# EAGLE design Power Stage (EAGLE 5.11)

## Sheet 1 of 5
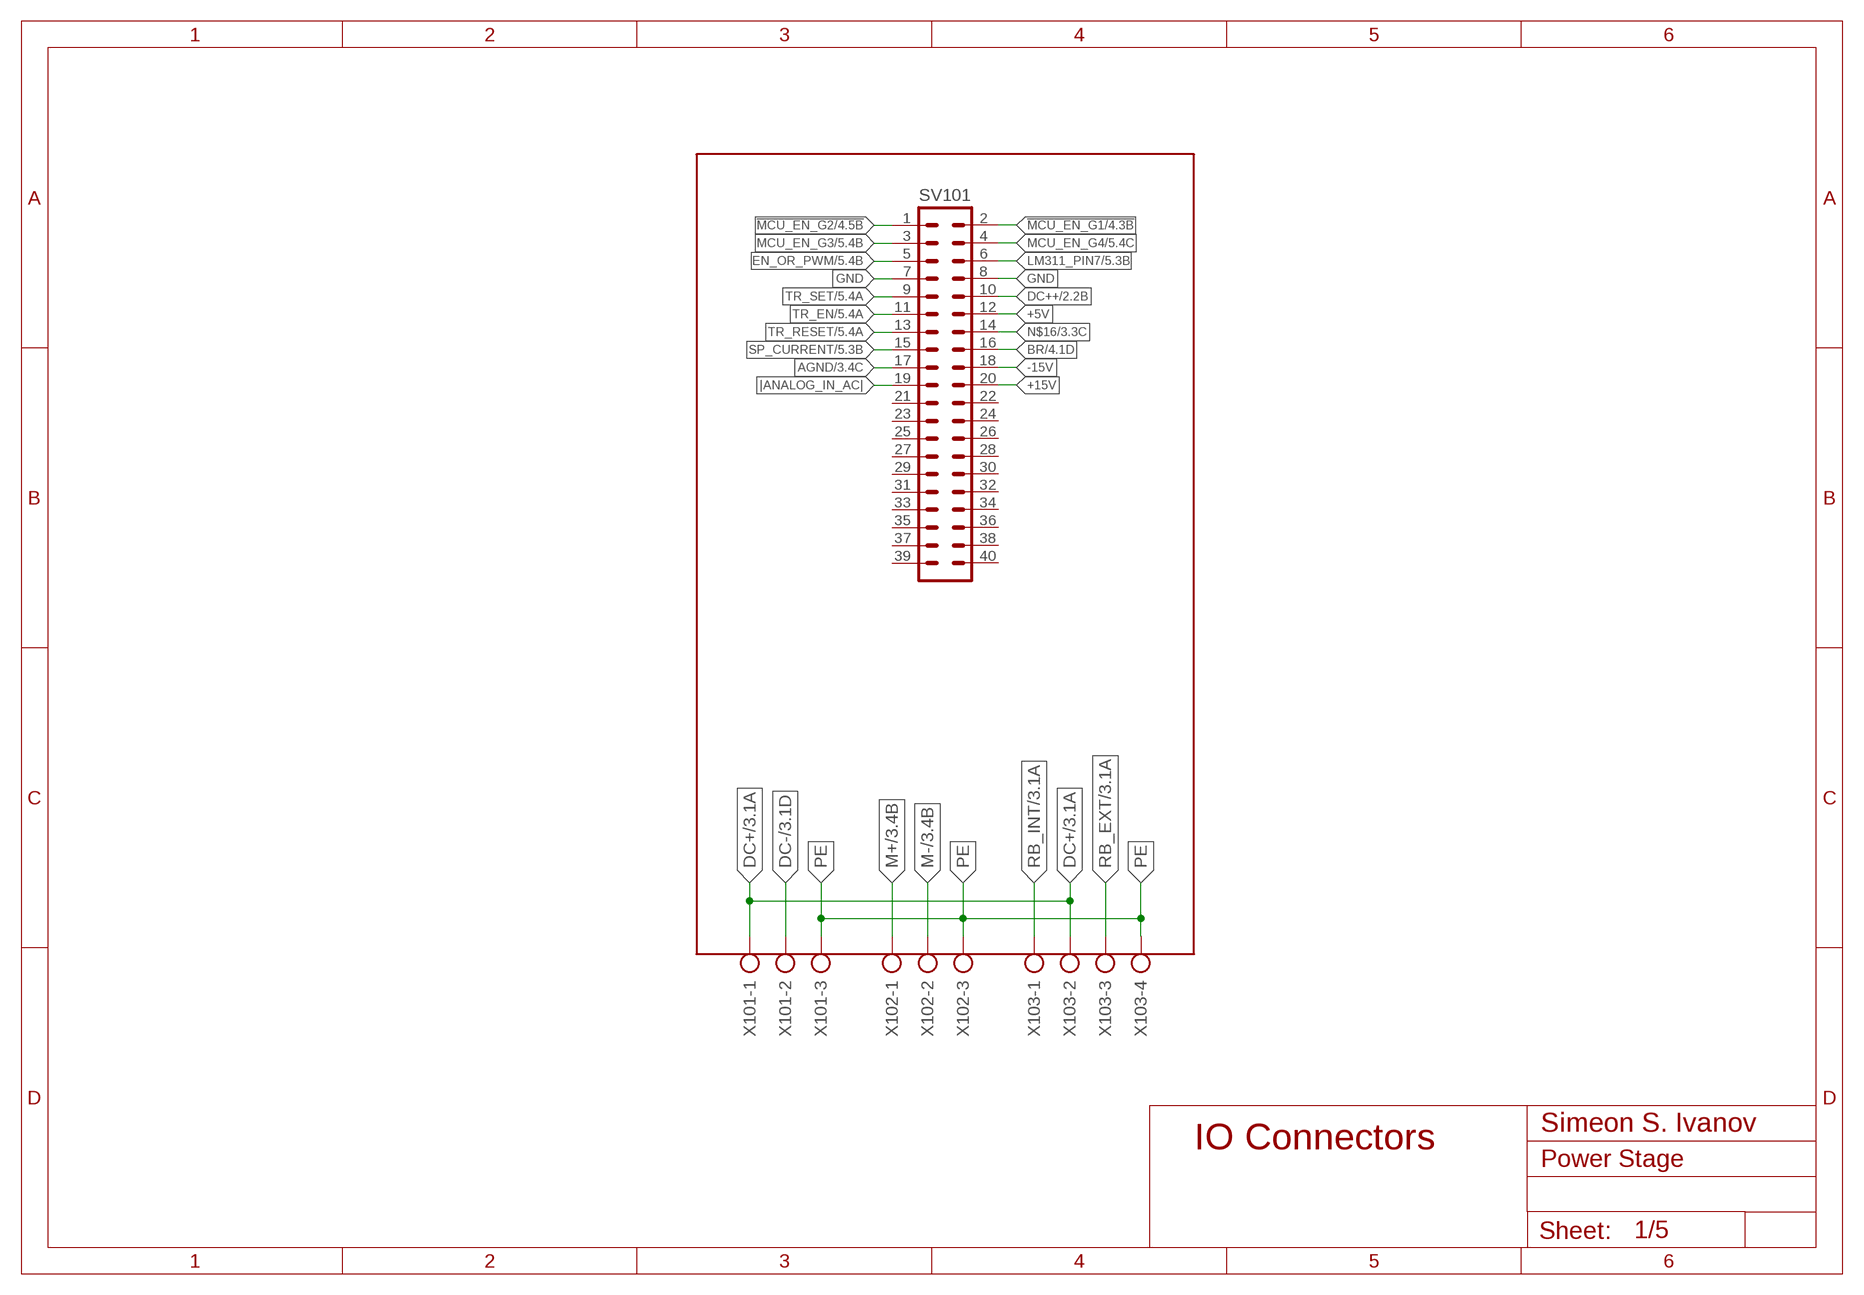
[diagram p0: schematic, sheet 1]

### Parts
SV101  ML40  [ML40]
X101  AK500/3-H  [AK500/3-H]
X102  AK500/3-H  [AK500/3-H]
X103  AK500/4-H  [AK500/4-H]

### Nets
!MCU_EN_G1: SV101.2 ; also sheet 4,5
!MCU_EN_G2: SV101.1 ; also sheet 4,5
+5V: SV101.12 ; also sheet 2,5
+15V: SV101.20 ; also sheet 2,5
-15V: SV101.18 ; also sheet 2,5
AGND: SV101.17 ; also sheet 2,3,5
BR: SV101.16 ; also sheet 4
DC+: X101.1 X103.2 ; also sheet 3
DC++: SV101.10 ; also sheet 2,3,4
DC-: X101.2 ; also sheet 3,4
EN_OR_PWM: SV101.5 ; also sheet 5
GND: SV101.7 SV101.8 ; also sheet 2,3,4,5
LM311_PIN7: SV101.6 ; also sheet 5
M+: X102.1 ; also sheet 3
M-: X102.2 ; also sheet 3
MCU_EN_G3: SV101.3 ; also sheet 5
MCU_EN_G4: SV101.4 ; also sheet 5
N$16: SV101.14 ; also sheet 3
PE: X101.3 X102.3 X103.4
RB_EXT: X103.3 ; also sheet 3
RB_INT: X103.1 ; also sheet 3
SP_CURRENT: SV101.15 ; also sheet 5
TR_EN: SV101.11 ; also sheet 5
TR_RESET: SV101.13 ; also sheet 5
TR_SET: SV101.9 ; also sheet 5
|ANALOG_IN_AC|: SV101.19 ; also sheet 5
Unconnected: SV101.21 SV101.22 SV101.23 SV101.24 SV101.25 SV101.26 SV101.27 SV101.28 SV101.29 SV101.30 SV101.31 SV101.32 SV101.33 SV101.34 SV101.35 SV101.36 SV101.37 SV101.38 SV101.39 SV101.40

### Notes on the sheet
- Simeon S. Ivanov
- IO Connectors

## Sheet 2 of 5
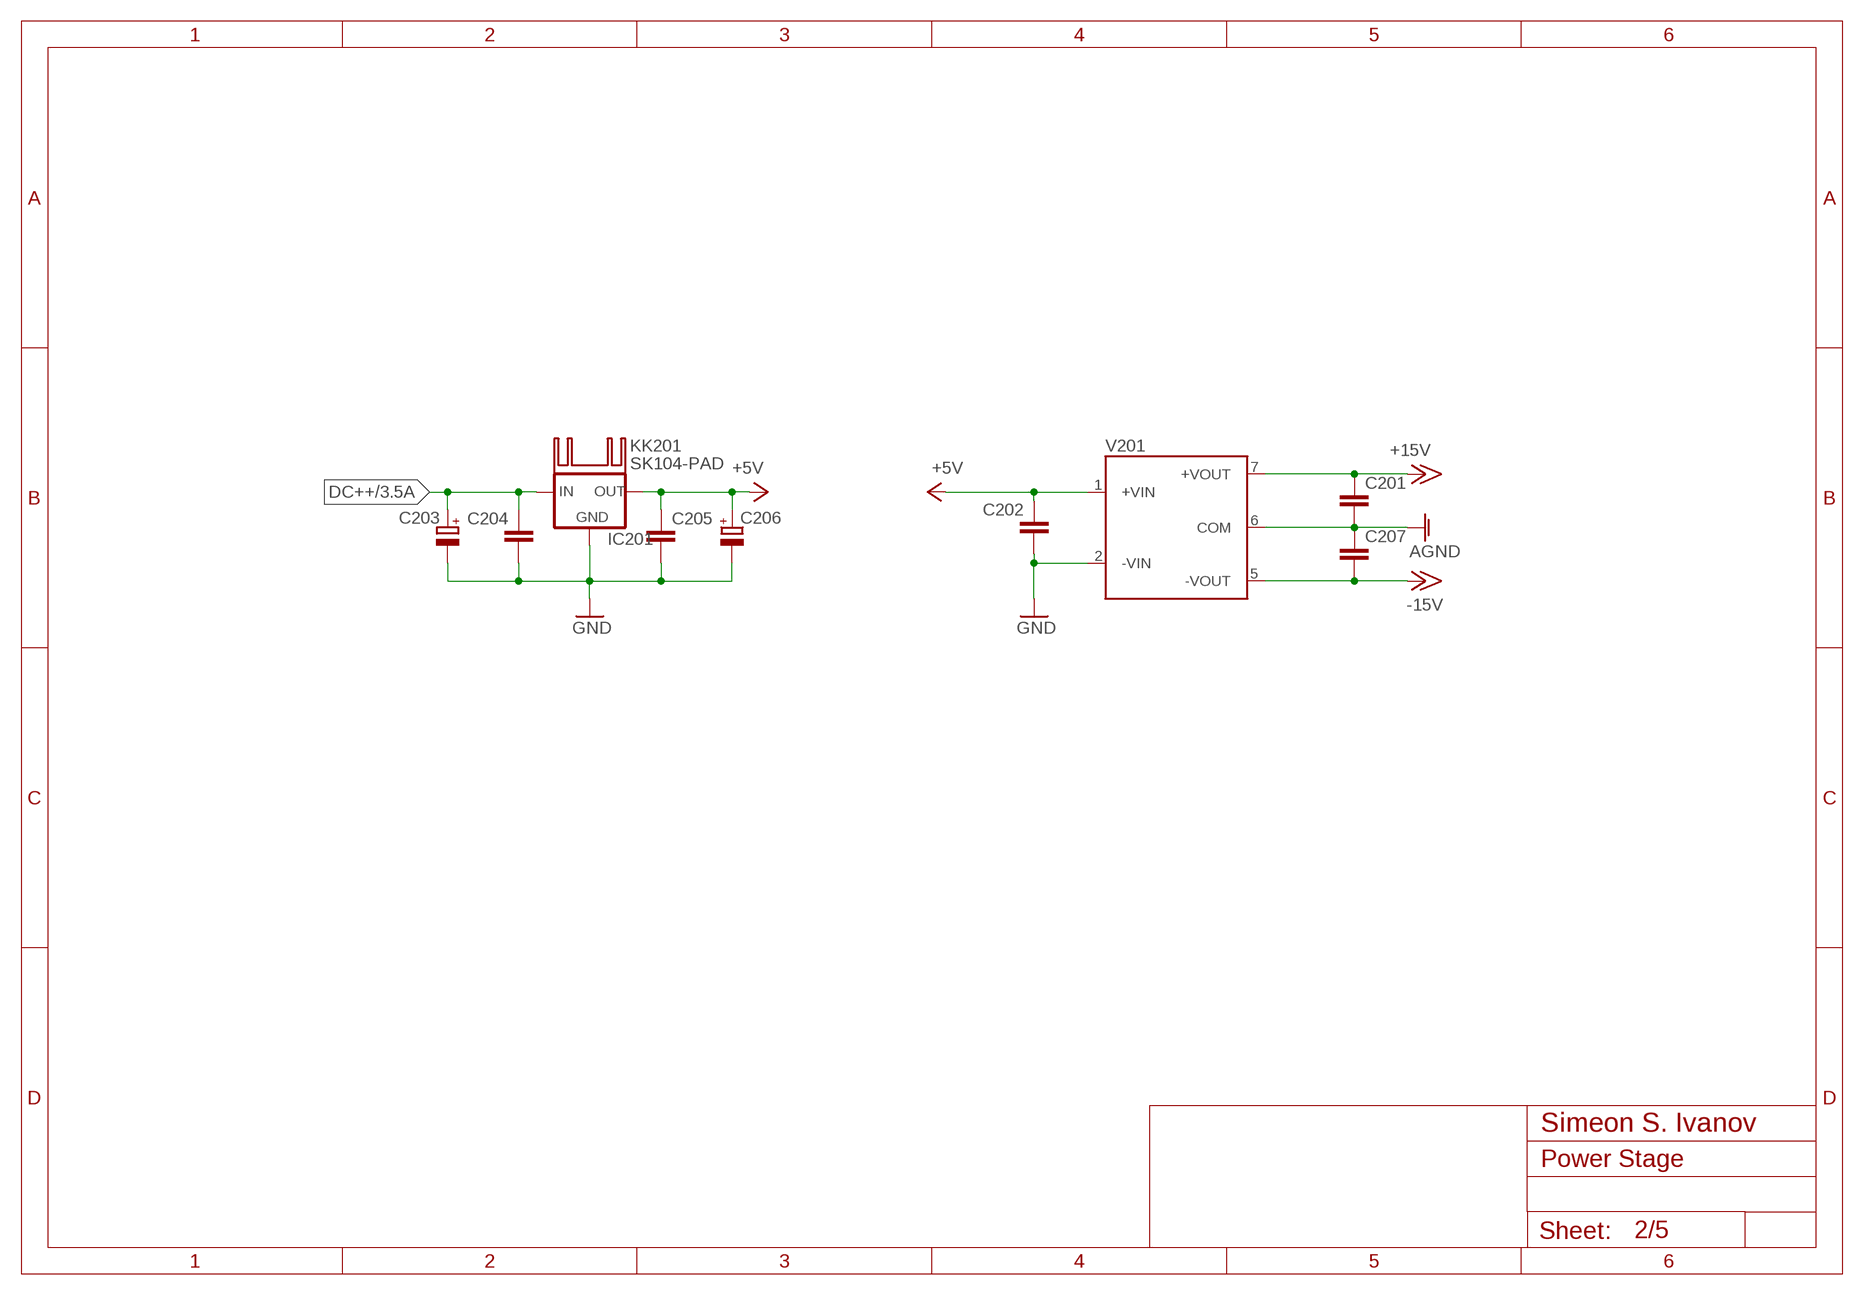
[diagram p1: schematic, sheet 2]

### Parts
C201  C-EU050-024X044  [C050-024X044]
C202  C-EU050-024X044  [C050-024X044]
C203  CPOL-EUE2.5-6  [E2,5-6]
C204  C-EU050-024X044  [C050-024X044]
C205  C-EU050-024X044  [C050-024X044]
C206  CPOL-EUE2.5-6  [E2,5-6]
C207  C-EU050-024X044  [C050-024X044]
IC201  78XXS  [78XXS]
KK201  SK104-PAD  [SK104-PAD]
V201  TMV0515D  [TMV_DUAL]

### Nets
+5V: C202.1 C205.1 C206.+ IC201.OUT V201.1(+VIN) ; also sheet 1,5
+15V: C201.1 V201.7(+VOUT) ; also sheet 1,5
-15V: C207.2 V201.5(-VOUT) ; also sheet 1,5
AGND: C201.2 C207.1 V201.6(COM) ; also sheet 1,3,5
DC++: C203.+ C204.1 IC201.IN ; also sheet 1,3,4
GND: C202.2 C203.- C204.2 C205.2 C206.- IC201.GND V201.2(-VIN) ; also sheet 1,3,4,5
Unconnected: KK201.K1(K) KK201.K2(K)

### Notes on the sheet
- Simeon S. Ivanov

## Sheet 3 of 5
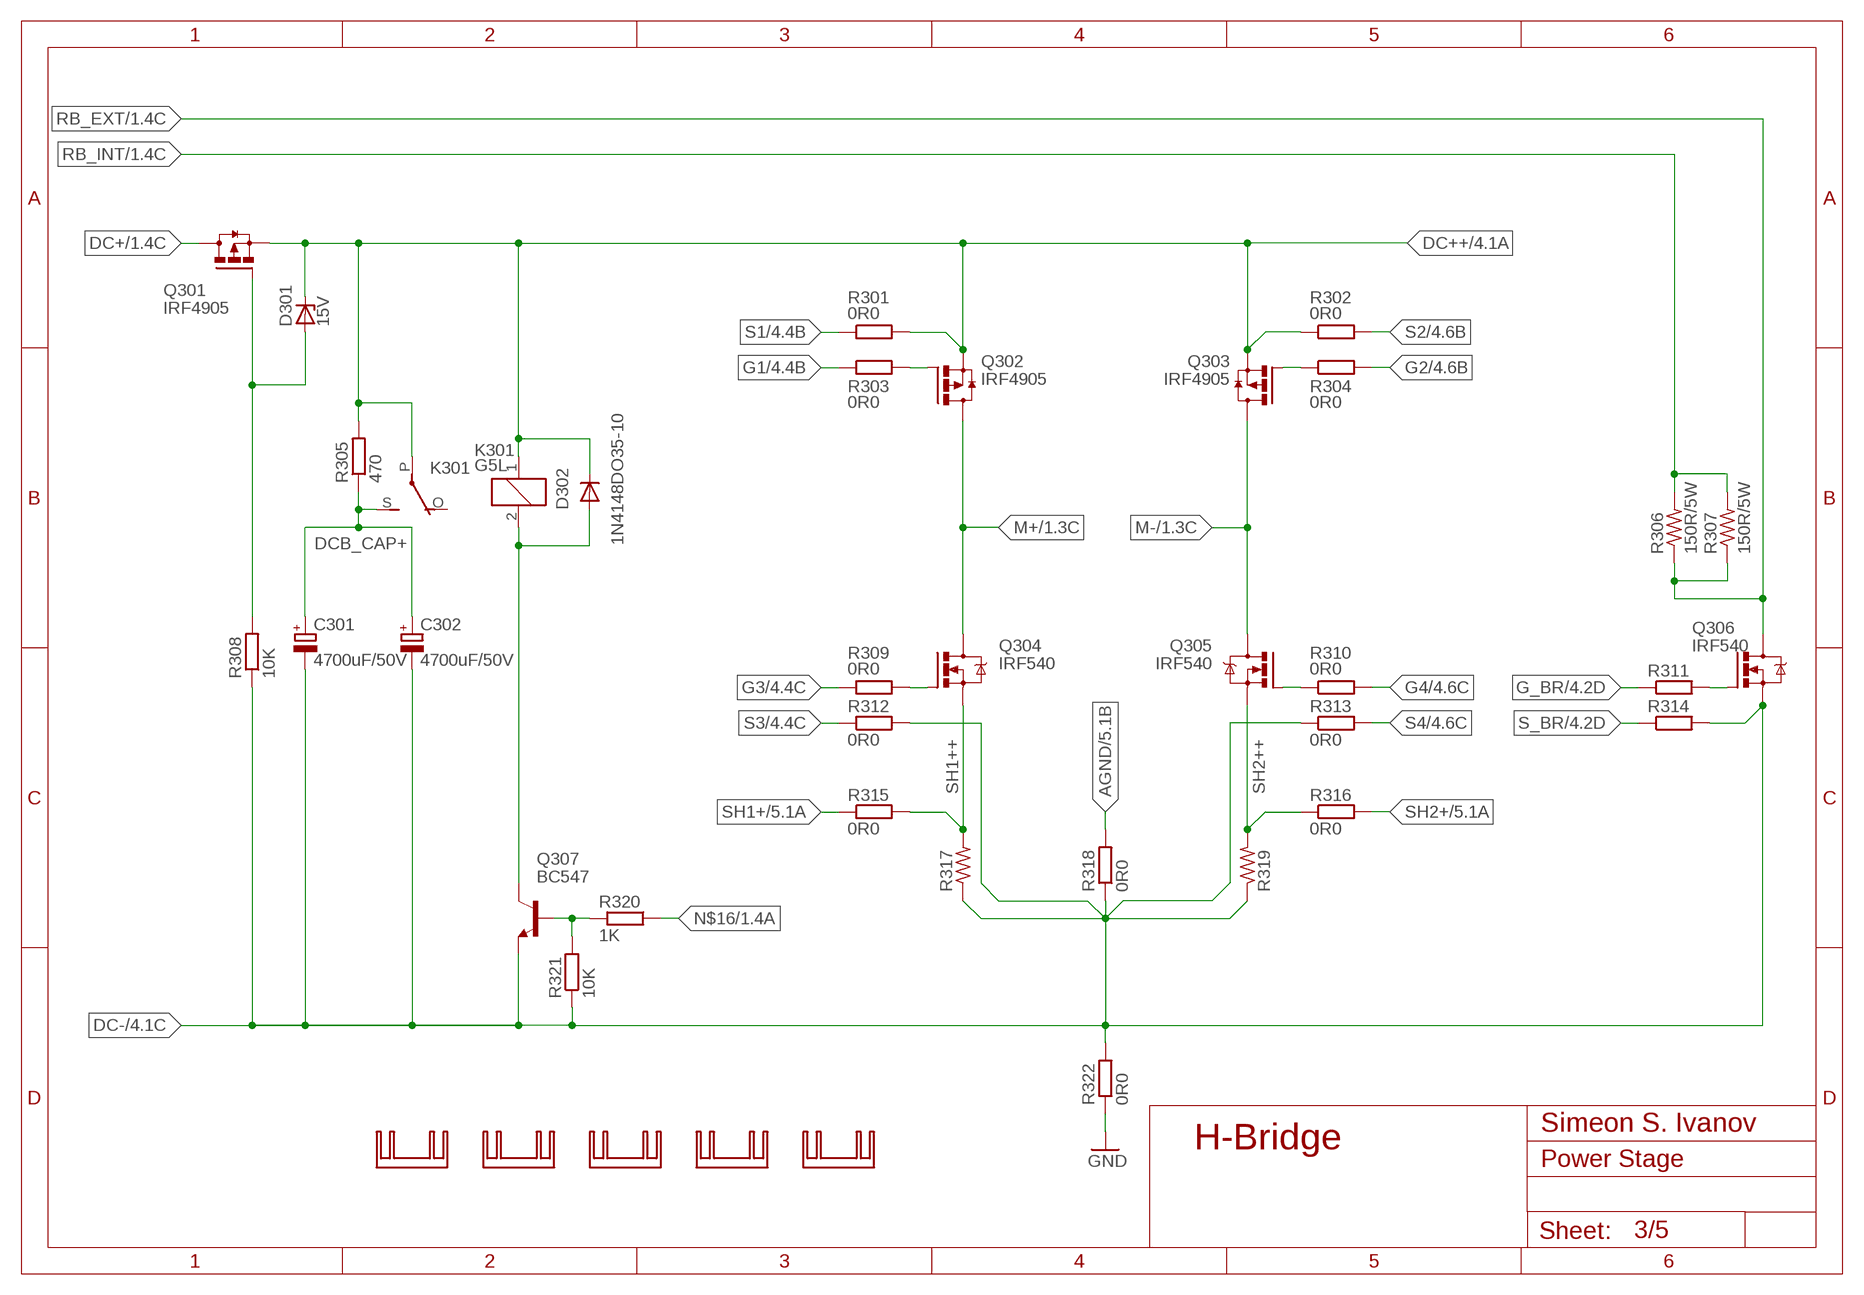
[diagram p2: schematic, sheet 3]

### Parts
C301  4700uF/50V  CPOL-EUE10-25  [EB25D]
C302  4700uF/50V  CPOL-EUE10-25  [EB25D]
D301  15V  ZENER-DIODEZD-5  [ZDIO-5]
D302  1N4148DO35-10  [DO35-10]
H301  KK-30  [KK-3]
H302  KK-30  [KK-3]
H303  KK-30  [KK-3]
H304  KK-30  [KK-3]
H305  KK-30  [KK-3]
K301  G5L  [G5LE]
Q301  IRF4905  PMOSFET_PTO220V  [TO220V]
Q302  IRF4905  PMOSFET_PTO220V  [TO220V]
Q303  IRF4905  PMOSFET_PTO220V  [TO220V]
Q304  IRF540  [TO220BV]
Q305  IRF540  [TO220BV]
Q306  IRF540  [TO220BV]
Q307  BC547  [TO92]
R301  0R0  R-EU_0207/10  [0207/10]
R302  0R0  R-EU_0207/10  [0207/10]
R303  0R0  R-EU_0207/10  [0207/10]
R304  0R0  R-EU_0207/10  [0207/10]
R305  470  R-EU_0414/15  [0414/15]
R306  150R/5W  R-US_VTA54  [VTA54]
R307  150R/5W  R-US_VTA54  [VTA54]
R308  10K  R-EU_0204/5  [0204/5]
R309  0R0  R-EU_0207/10  [0207/10]
R310  0R0  R-EU_0207/10  [0207/10]
R311  R-EU_0207/10  [0207/10]
R312  0R0  R-EU_0207/10  [0207/10]
R313  0R0  R-EU_0207/10  [0207/10]
R314  R-EU_0207/10  [0207/10]
R315  0R0  R-EU_0207/10  [0207/10]
R316  0R0  R-EU_0207/10  [0207/10]
R317  R-US_R1218  [R1218]
R318  0R0  R-EU_0207/10  [0207/10]
R319  R-US_R1218  [R1218]
R320  1K  R-EU_0207/10  [0207/10]
R321  10K  R-EU_0204/2V  [0204V]
R322  0R0  R-EU_0204/7  [0204/7]

### Nets
AGND: R318.2 ; also sheet 1,2,5
DC+: Q301.2(D) ; also sheet 1
DC++: D301.C D302.C K301.1 K301.P(2:P) Q301.3(S) Q302.3(S) Q303.3(S) R301.2 R302.1 R305.2 ; also sheet 1,2,4
DC-: C301.- C302.- Q306.S Q307.1(E) R308.1 R312.2 R313.1 R314.2 R317.1 R318.1 R319.1 R321.1 R322.2 ; also sheet 1,4
DCB_CAP+: C301.+ C302.+ K301.S(2:S) R305.1
G1: R303.1 ; also sheet 4
G2: R304.2 ; also sheet 4
G3: R309.1 ; also sheet 4
G4: R310.2 ; also sheet 4
G_BR: R311.1 ; also sheet 4
GND: R322.1 ; also sheet 1,2,4,5
M+: Q302.2(D) Q304.D ; also sheet 1
M-: Q303.2(D) Q305.D ; also sheet 1
N$12: D302.A K301.2 Q307.3(C)
N$15: Q307.2(B) R320.2 R321.2
N$16: R320.1 ; also sheet 1
N$19: D301.A Q301.1(G) R308.2
N$20: Q306.G R311.2
Q1_G: Q302.1(G) R303.2
Q2_G: Q303.1(G) R304.1
Q3_G: Q304.G R309.2
Q4_G: Q305.G R310.1
RB_EXT: Q306.D R306.1 R307.1 ; also sheet 1
RB_INT: R306.2 R307.2 ; also sheet 1
S1: R301.1 ; also sheet 4
S2: R302.2 ; also sheet 4
S3: R312.1 ; also sheet 4
S4: R313.2 ; also sheet 4
S_BR: R314.1 ; also sheet 4
SH1+: R315.1 ; also sheet 5
SH1++: Q304.S R315.2 R317.2
SH2+: R316.2 ; also sheet 5
SH2++: Q305.S R316.1 R319.2
Unconnected: K301.O(2:O)

### Notes on the sheet
- Simeon S. Ivanov
- H-Bridge

## Sheet 4 of 5
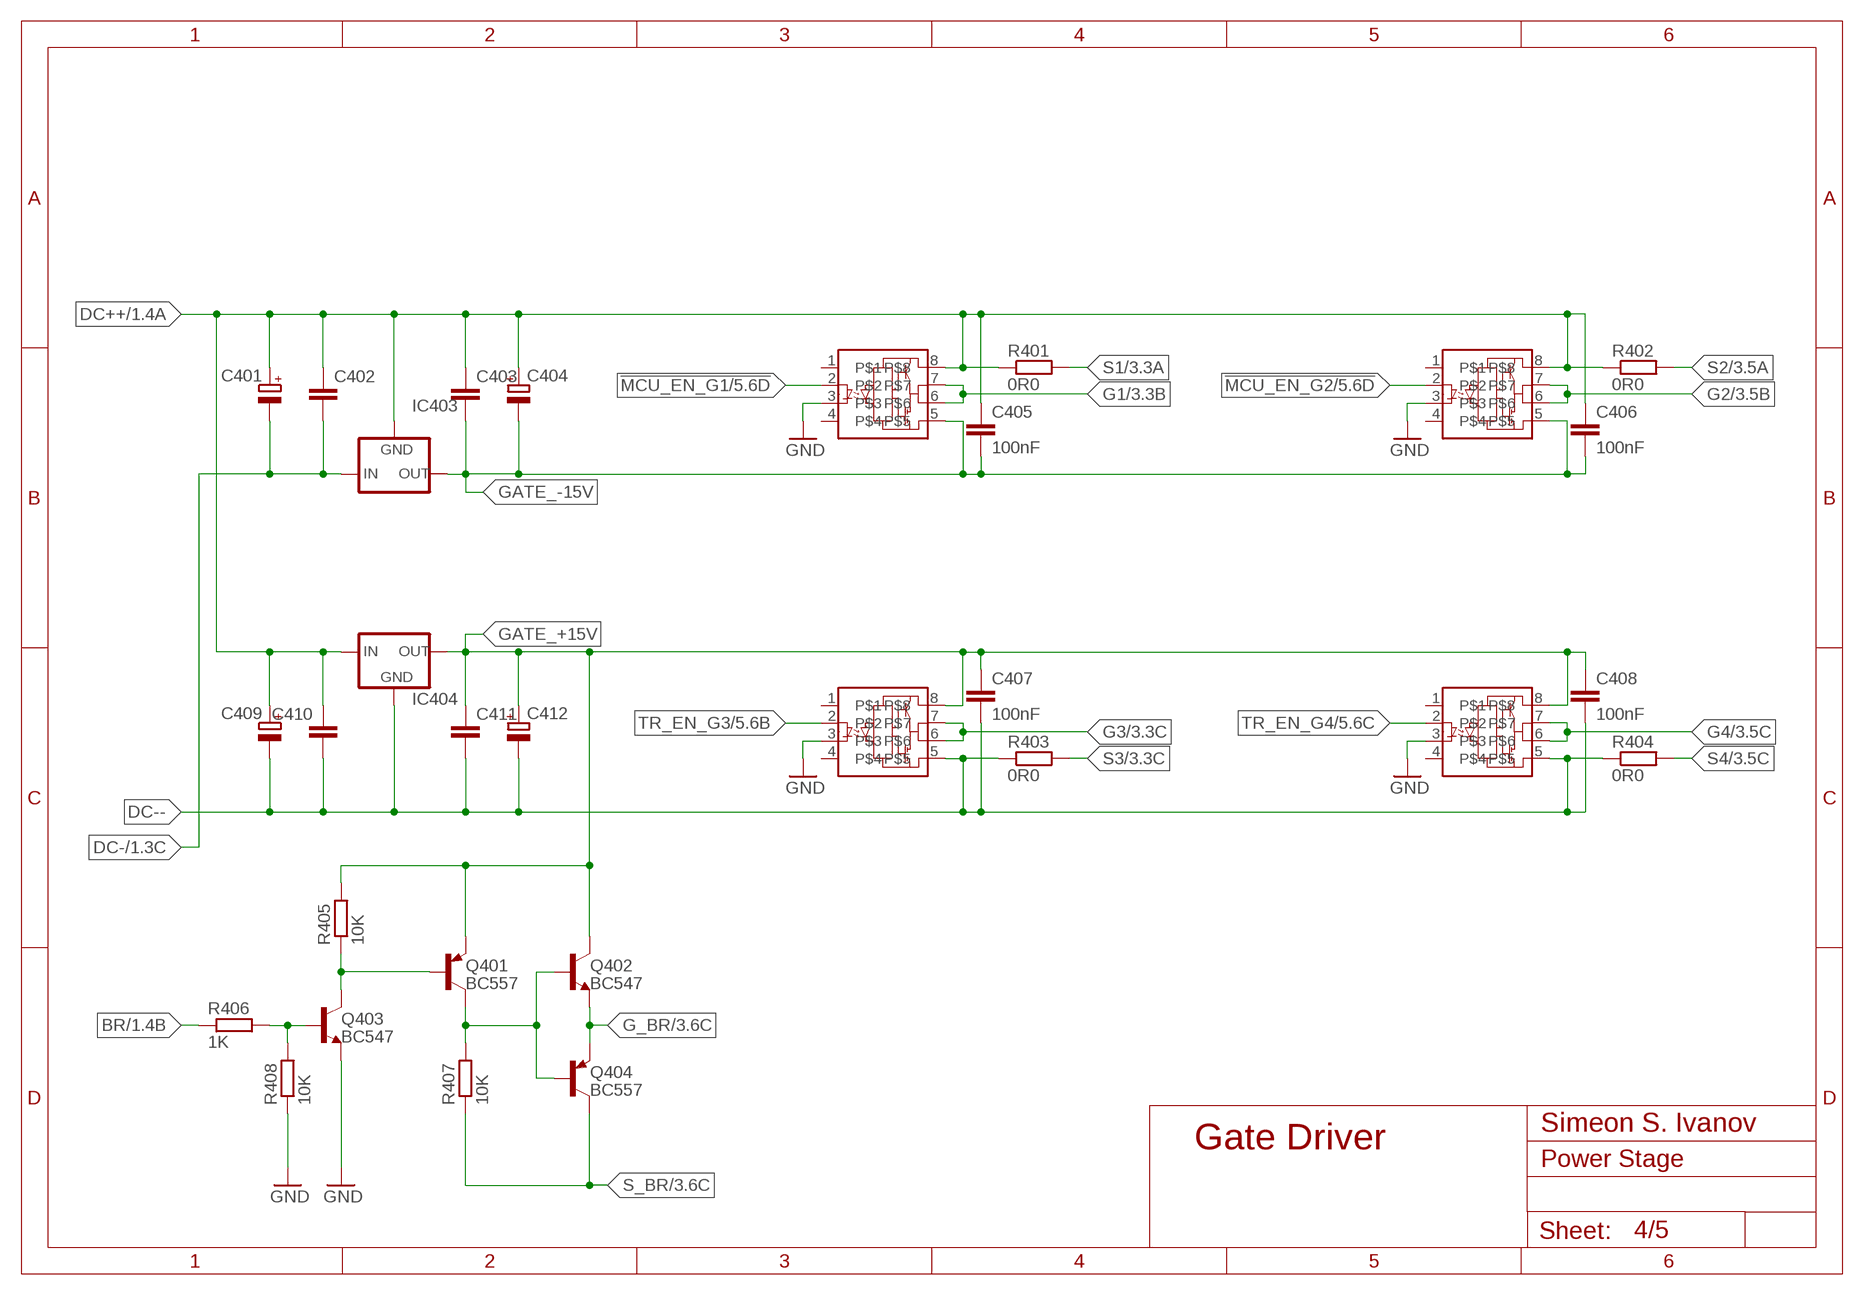
[diagram p3: schematic, sheet 4]

### Parts
C401  CPOL-EUE2.5-6  [E2,5-6]
C402  C-EU050-024X044  [C050-024X044]
C403  C-EU050-024X044  [C050-024X044]
C404  CPOL-EUE2.5-6  [E2,5-6]
C405  100nF  C-EU050-024X044  [C050-024X044]
C406  100nF  C-EU050-024X044  [C050-024X044]
C407  100nF  C-EU050-024X044  [C050-024X044]
C408  100nF  C-EU050-024X044  [C050-024X044]
C409  CPOL-EUE2.5-6  [E2,5-6]
C410  C-EU050-024X044  [C050-024X044]
C411  C-EU050-024X044  [C050-024X044]
C412  CPOL-EUE2.5-6  [E2,5-6]
IC401  ELDI  [DIL8-SMD]
IC402  ELDI  [DIL8-SMD]
IC403  79XXS  [79XXS]
IC404  78XXS  [78XXS]
IC405  ELDI  [DIL8-SMD]
IC406  ELDI  [DIL8-SMD]
Q401  BC557  [TO92-EBC]
Q402  BC547  BC548  [TO92-EBC]
Q403  BC547  BC548  [TO92-EBC]
Q404  BC557  [TO92-EBC]
R401  0R0  R-EU_R1206  [R1206]
R402  0R0  R-EU_R1206  [R1206]
R403  0R0  R-EU_R1206  [R1206]
R404  0R0  R-EU_R1206  [R1206]
R405  10K  R-EU_0204/2V  [0204V]
R406  1K  R-EU_0204/2V  [0204V]
R407  10K  R-EU_0204/2V  [0204V]
R408  10K  R-EU_0204/2V  [0204V]

### Nets
!MCU_EN_G1: IC401.2 ; also sheet 1,5
!MCU_EN_G2: IC402.2 ; also sheet 1,5
BR: R406.2 ; also sheet 1
DC++: C401.+ C402.1 C403.1 C404.+ C405.1 C406.1 C409.+ C410.1 IC401.8 IC402.8 IC403.GND IC404.IN R401.1 R402.1 ; also sheet 1,2,3
DC-: C401.- C402.2 IC403.IN ; also sheet 1,3
DC--: C407.2 C408.2 C409.- C410.2 C411.2 C412.- IC404.GND IC405.5 IC406.5 R403.1 R404.1
G1: IC401.6 IC401.7 ; also sheet 3
G2: IC402.6 IC402.7 ; also sheet 3
G3: IC405.6 IC405.7 ; also sheet 3
G4: IC406.6 IC406.7 ; also sheet 3
G_BR: Q402.E Q404.E ; also sheet 3
GATE_+15V: C407.1 C408.1 C411.1 C412.+ IC404.OUT IC405.8 IC406.8 Q401.E Q402.C R405.2
GATE_-15V: C403.2 C404.- C405.2 C406.2 IC401.5 IC402.5 IC403.OUT
GND: IC401.3 IC402.3 IC405.3 IC406.3 Q403.E R408.1 ; also sheet 1,2,3,5
N$11: Q403.B R406.1 R408.2
N$64: Q401.B Q403.C R405.1
N$87: Q401.C Q402.B Q404.B R407.2
S1: R401.2 ; also sheet 3
S2: R402.2 ; also sheet 3
S3: R403.2 ; also sheet 3
S4: R404.2 ; also sheet 3
S_BR: Q404.C R407.1 ; also sheet 3
TR_EN_G3: IC405.2 ; also sheet 5
TR_EN_G4: IC406.2 ; also sheet 5
Unconnected: IC401.1 IC401.4 IC402.1 IC402.4 IC405.1 IC405.4 IC406.1 IC406.4

### Notes on the sheet
- Simeon S. Ivanov
- Gate Driver

## Sheet 5 of 5
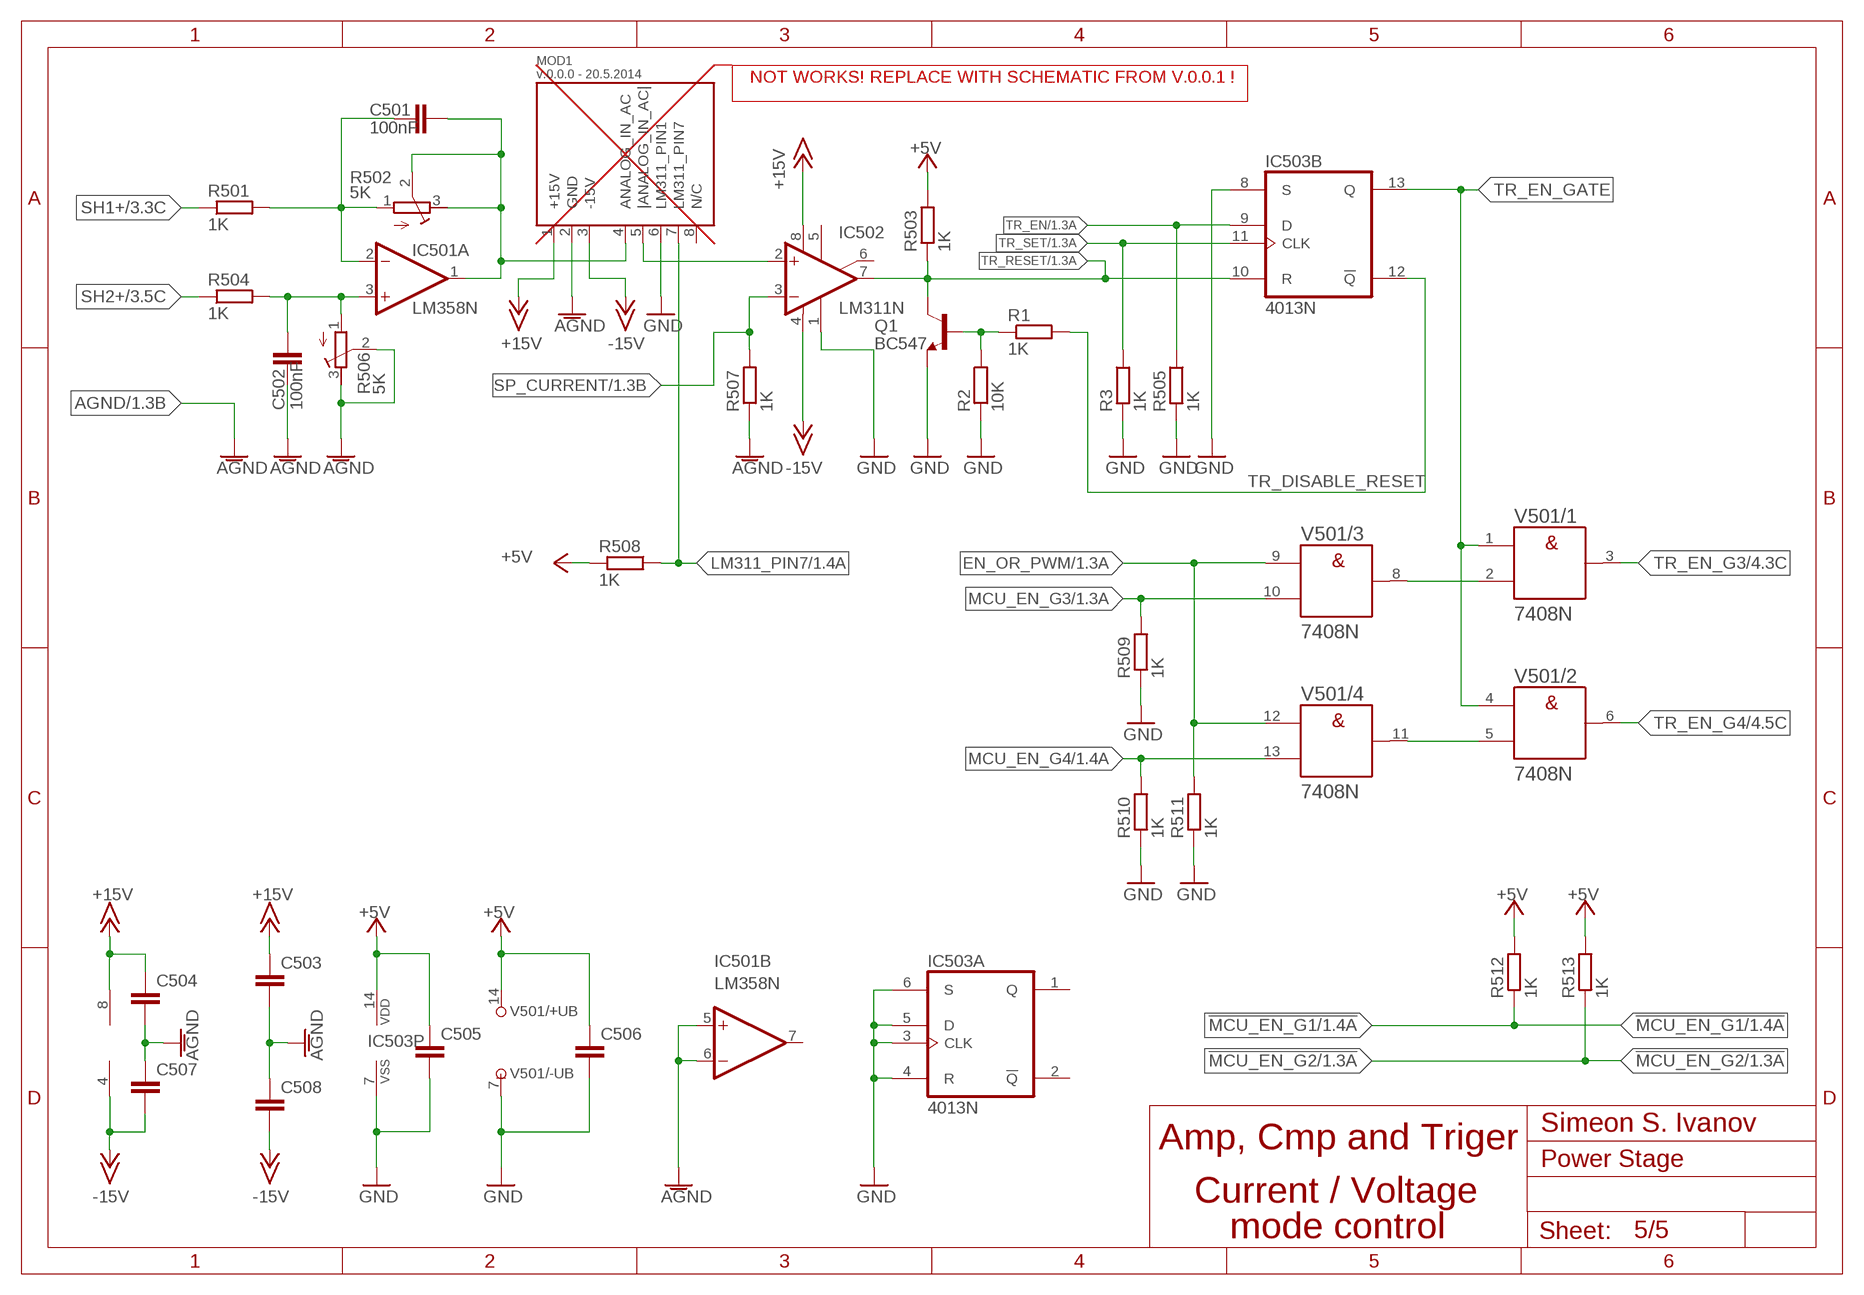
[diagram p4: schematic, sheet 5]

### Parts
C501  100nF  C-EU050-024X044  [C050-024X044]
C502  100nF  C-EU050-024X044  [C050-024X044]
C503  C-EUC0805  [C0805]
C504  C-EUC0805  [C0805]
C505  C-EU050-024X044  [C050-024X044]
C506  C-EU050-024X044  [C050-024X044]
C507  C-EUC0805  [C0805]
C508  C-EUC0805  [C0805]
IC501  LM358N  [DIL08]
IC502  LM311N  [DIL08]
IC503  4013N  [DIL14]
MOD1  V.0.0.0_20.5.2014  [V.0.0.0_20.5.2014]
Q1  BC547  BC548  [TO92-EBC]
R1  1K  R-EU_0204/2V  [0204V]
R2  10K  R-EU_0204/2V  [0204V]
R3  1K  R-EU_0204/2V  [0204V]
R501  1K  R-EU_0204/7  [0204/7]
R502  5K  R-TRIMM3296W  [RTRIM3296W]
R503  1K  R-EU_0204/2V  [0204V]
R504  1K  R-EU_0204/7  [0204/7]
R505  1K  R-EU_0204/2V  [0204V]
R506  5K  R-TRIMM3296W  [RTRIM3296W]
R507  1K  R-EU_0204/2V  [0204V]
R508  1K  R-EU_0204/2V  [0204V]
R509  1K  R-EU_0204/2V  [0204V]
R510  1K  R-EU_0204/2V  [0204V]
R511  1K  R-EU_0204/2V  [0204V]
R512  1K  R-EU_0204/7  [0204/7]
R513  1K  R-EU_0204/7  [0204/7]
V501  7408N  [DIL14]

### Nets
!MCU_EN_G1: R512.2 ; also sheet 1,4
!MCU_EN_G2: R513.2 ; also sheet 1,4
+5V: C505.1 C506.1 IC503.14(P:VDD) R503.2 R508.2 R512.1 R513.1 V501.14(/+UB:+UB) ; also sheet 1,2
+15V: C503.1 C504.1 IC501.8(P:V+) IC502.8(V+) MOD1.1(+15V) ; also sheet 1,2
-15V: C507.2 C508.2 IC501.4(P:V-) IC502.4(V-) MOD1.3(-15V) ; also sheet 1,2
AGND: C502.1 C503.2 C504.2 C507.1 C508.1 IC501.5(B:+IN) IC501.6(B:-IN) MOD1.2(GND) R506.2(S) R506.3(A) R507.1 ; also sheet 1,2,3
ANALOG_IN_AC: C501.2 IC501.1(A:OUT) MOD1.4(ANALOG_IN_AC) R502.2(S) R502.3(A)
EN_OR_PWM: R511.1 V501.9(/3:A) V501.12(/4:A) ; also sheet 1
GND: C505.2 C506.2 IC502.1(GND) IC503.3(A:CLK) IC503.4(A:R) IC503.5(A:D) IC503.6(A:S) IC503.7(P:VSS) IC503.8(B:S) MOD1.6(LM311_PIN1) Q1.E R2.2 R3.2 R505.2 R509.2 R510.2 R511.2 V501.7(/-UB:-UB) ; also sheet 1,2,3,4
LM311_PIN7: MOD1.7(LM311_PIN7) R508.1 ; also sheet 1
MCU_EN_G3: R509.1 V501.10(/3:B) ; also sheet 1
MCU_EN_G4: R510.1 V501.13(/4:B) ; also sheet 1
N$6: C501.1 IC501.2(A:-IN) R501.2 R502.1(E)
N$10: C502.2 IC501.3(A:+IN) R504.2 R506.1(E)
N$37: V501.2(/1:B) V501.8(/3:Y)
N$38: V501.5(/2:B) V501.11(/4:Y)
N$100: Q1.B R1.1 R2.1
SH1+: R501.1 ; also sheet 3
SH2+: R504.1 ; also sheet 3
SP_CURRENT: IC502.3(-IN) R507.2 ; also sheet 1
TR_DISABLE_RESET: IC503.12(B:!Q) R1.2
TR_EN: IC503.9(B:D) R505.1 ; also sheet 1
TR_EN_G3: V501.3(/1:Y) ; also sheet 4
TR_EN_G4: V501.6(/2:Y) ; also sheet 4
TR_EN_GATE: IC503.13(B:Q) V501.1(/1:A) V501.4(/2:A)
TR_RESET: IC502.7(OUT) IC503.10(B:R) Q1.C R503.1 ; also sheet 1
TR_SET: IC503.11(B:CLK) R3.1 ; also sheet 1
|ANALOG_IN_AC|: IC502.2(+IN) MOD1.5(|ANALOG_IN_AC|) ; also sheet 1
Unconnected: IC501.7(B:OUT) IC502.5(ON) IC502.6(ON/STR) IC503.1(A:Q) IC503.2(A:!Q) MOD1.8(N/C)

### Notes on the sheet
- NOT WORKS! REPLACE WITH SCHEMATIC FROM V.0.0.1 !
- Simeon S. Ivanov
- Amp, Cmp and Triger
- Current / Voltage
- mode control

## Library data of the parts
C201 C202 C204 C205 C207 C402 C403 C405-C408 C410 C411 C501-C508 = rcl:C-EU: CAPACITOR, European symbol
C203 C206 C301 C302 C401 C404 C409 C412 = rcl:CPOL-EU: POLARIZED CAPACITOR, European symbol
D301 = diode:ZENER-DIODE: Z-Diode
D302 = diode:1N4148: DIODE high speed (Philips)
H301-H305 = heatsink:KK-3
IC201 IC404 = v-reg:78XXS: VOLTAGE REGULATOR
IC401 IC402 IC405 IC406 = myOptocoupler:ELDI
IC403 = v-reg:79XXS: VOLTAGE REGULATOR
IC501 = linear:LM358: OP AMP also LM158; LM258; LM2904 Source: http://cache.national.com/ds/LM/LM158.pdf
IC502 = linear:LM311: COMPARATOR
IC503 = 40xx:4013: Dual D FLIP FLOP, set/reset
K301 = relay:G5L: RELAY 1 x switch, 10 A/120 V AC, 8 A/30 V ADC, Omron; OC_FARNELL: unknown; OC_NEWARK: unknown
KK201 = heatsink:SK104-PAD: HEATSINK manufacturer Fischer/distributor Buerklin
MOD1 = Precision Rectifier:V.0.0.0_20.5.2014
Q1 Q402 Q403 = transistor-npn:BC548*: NPN Transistor
Q301-Q303 = myTransistor-Power:PMOSFET_P
Q304-Q306 = transistor-power:IRF540: HEXFET Power MOSFET
Q307 = transistor-npn:BC547*: NPN Transistor
Q401 Q404 = transistor-pnp:BC557*: PNP Transistror
R1-R3 R301-R305 R308-R316 R318 R320-R322 R401-R408 R501 R503-R505 R507-R513 = rcl:R-EU_: RESISTOR, European symbol
R306 R307 R317 R319 = rcl:R-US_: RESISTOR, American symbol
R502 R506 = rcl:R-TRIMM: Trimm resistor
SV101 = con-harting-ml:ML40: HARTING; OC_FARNELL: unknown; OC_NEWARK: unknown
V201 = myTraco-electronic:TMV*?
V501 = 74ttl-din:74*08: Quad 2-input AND gate
X101 X102 = con-ptr500:AK500/3-H: CONNECTOR Aug. 2004 / PTR Meßtechnik: Die Bezeichnung der Serie AK505 wurde geändert. Es handelt sich hierbei um AK500 in horizontaler Ausführung.; OC_FARNELL: unknown; OC_NEWARK: unknown
X103 = con-ptr500:AK500/4-H: CONNECTOR Aug. 2004 / PTR Meßtechnik: Die Bezeichnung der Serie AK505 wurde geändert. Es handelt sich hierbei um AK500 in horizontaler Ausführung.; OC_FARNELL: unknown; OC_NEWARK: unknown

## Board
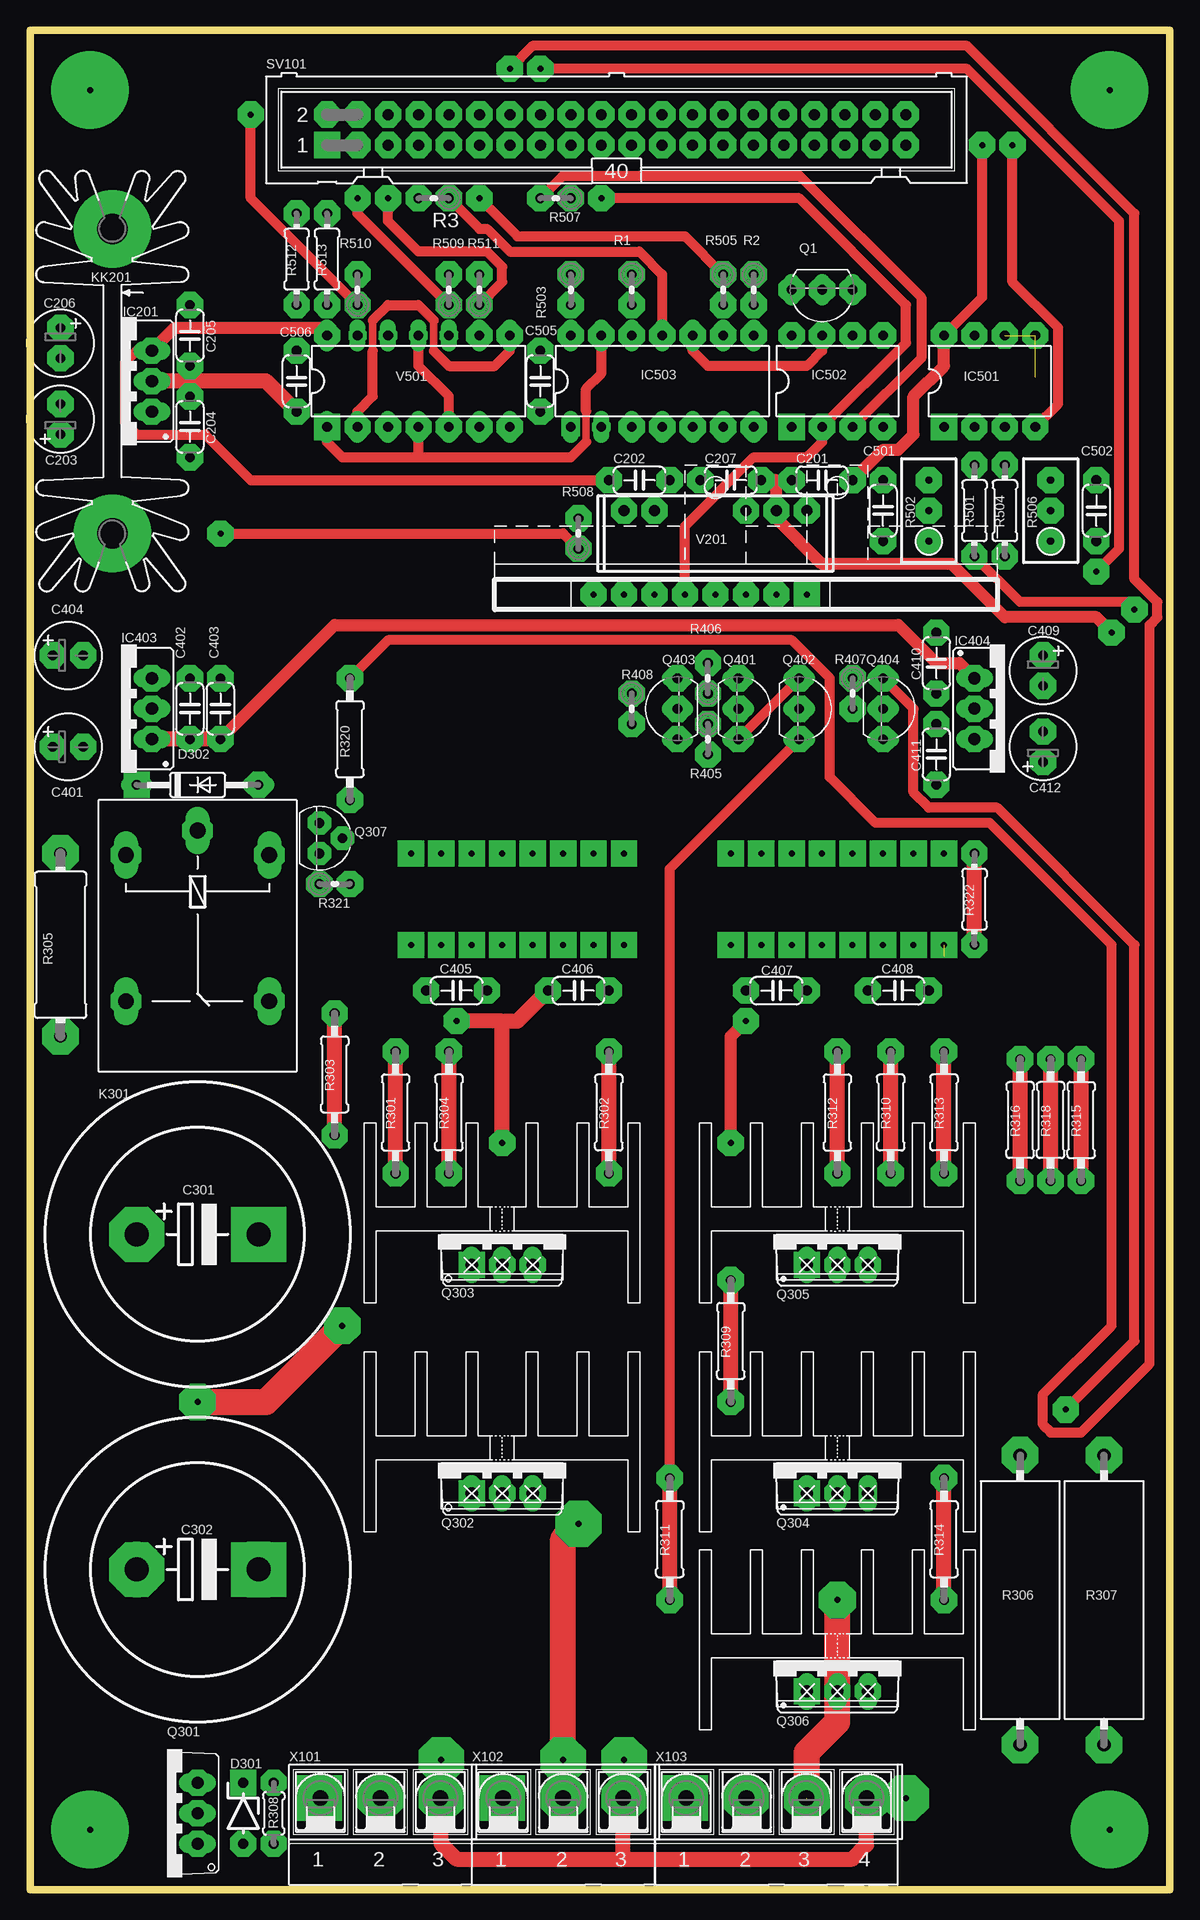
[diagram p5: board, top side]
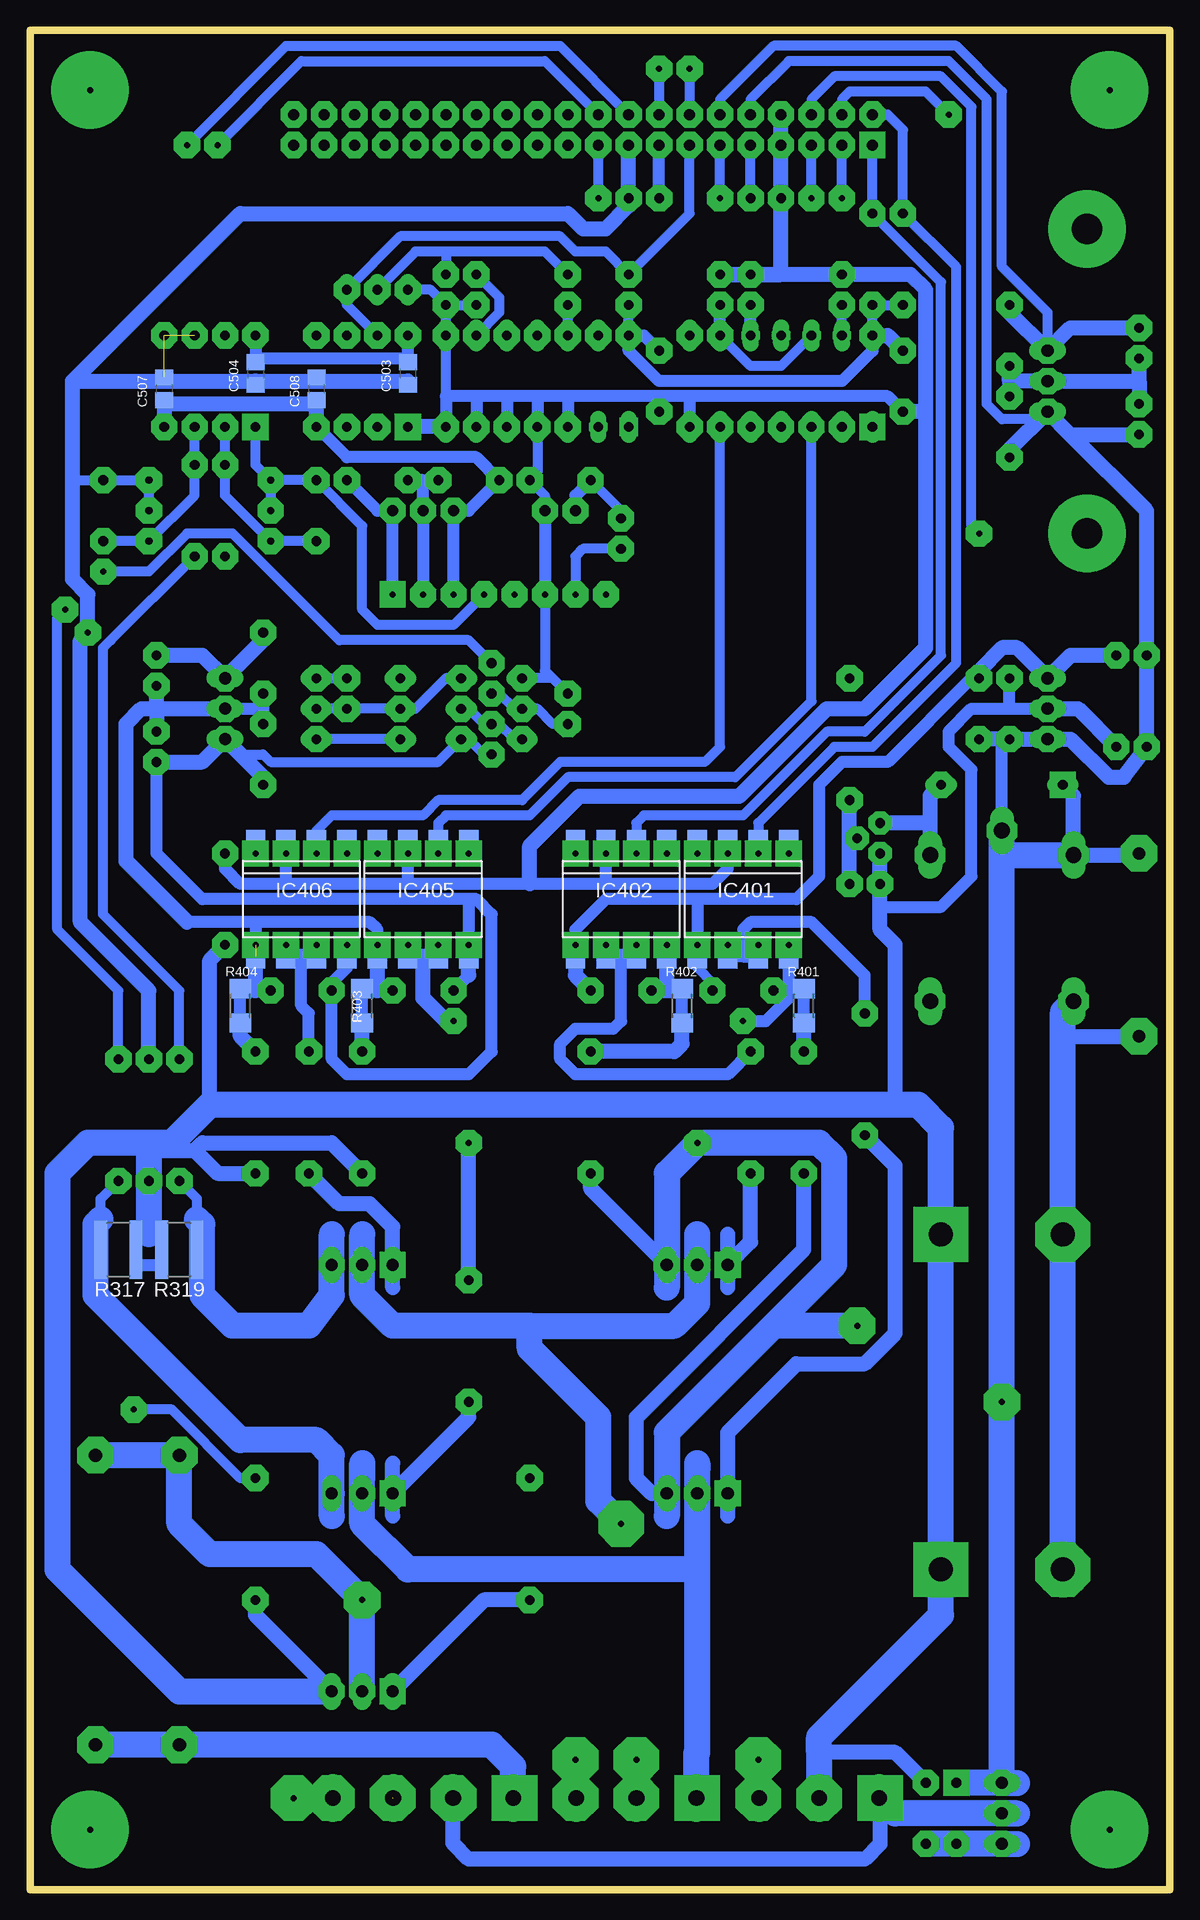
[diagram p6: board, bottom side, seen from below]

Size 95 x 155 mm. Coordinates in mm from the lower left corner, seen from the top.
Outline: 0,0 95,0 95,155 0,155 0,0
Copper layers (1*16): Top 0.035mm / dielectric 1.5mm / Bottom 0.035mm
Design rules "default": minimum track width 10mil, minimum drill 24mil, track to track 8mil, track to pad 8mil, pad to pad 8mil, via to via 8mil, smd to smd 8mil, copper to edge 40mil, drill to drill 8mil, minimum pad ring 10mil, minimum via ring 8mil, stop-mask expansion 4mil, vias tented up to drill 0mil, thermal gap 10mil

### Footprints (pad centres in the part's own frame; a part is rotated, then mirrored left to right if it is on the bottom)
C050-024X044 = drill 0.813 octagon: 1 -2.54,0; 2 2.54,0
E2,5-6 = drill 0.813 pad 1.6 round: + -1.27,0 | drill 0.813 pad 1.6 octagon: - 1.27,0
EB25D = drill 2.007 pad 4.597 round: + -5.08,0 | drill 2.007 pad 4.597 octagon: - 5.08,0
C0805 = smd 1.3 x 1.5: 1 -0.95,0; 2 0.95,0
ZDIO-5 = drill 0.813 octagon: A 2.54,0; C -2.54,0
DO35-10 = drill 0.813 long: A 5.08,0; C -5.08,0
78XXS = drill 1.016 long: GND 0,-2.54; IN -2.54,-2.54; OUT 2.54,-2.54
DIL8-SMD = smd 1.6 x 2: 1 -3.81,-4.77; 2 -1.27,-4.77; 3 1.27,-4.77; 4 3.81,-4.77; 5 3.81,4.77; 6 1.27,4.77; 7 -1.27,4.77; 8 -3.81,4.77
79XXS = drill 1.016 long: GND -2.54,-2.54; IN 0,-2.54; OUT 2.54,-2.54
DIL08 = drill 0.813 pad 1.27 round: 1 -3.81,-3.81; 2 -1.27,-3.81; 3 1.27,-3.81; 4 3.81,-3.81; 5 3.81,3.81; 6 1.27,3.81; 7 -1.27,3.81; 8 -3.81,3.81
DIL14 = drill 0.813 long: 1 -7.62,-3.81; 2 -5.08,-3.81; 3 -2.54,-3.81; 4 0,-3.81; 5 2.54,-3.81; 6 5.08,-3.81; 7 7.62,-3.81; 8 7.62,3.81; 9 5.08,3.81; 10 2.54,3.81; 11 0,3.81; 12 -2.54,3.81; 13 -5.08,3.81; 14 -7.62,3.81
G5LE = drill 1.321 long: 1 -7.493,-5.969; 2 -7.493,5.969; O 4.699,5.969; P -9.525,0; S 4.699,-5.969
SK104-PAD = drill 2.54 pad 3.81 round: K1 -12.7,-0.762; K2 12.7,-0.762
V.0.0.0_20.5.2014 = drill 0.5 pad 2.184 square: 1 0,0 | drill 0.5 pad 2.184 octagon: 2 2.54,0; 3 5.08,0; 4 7.62,0; 5 10.16,0; 6 12.7,0; 7 15.24,0; 8 17.78,0
TO92-EBC = drill 0.813 long: B 0,-1.27; C -2.54,-1.27; E 2.54,-1.27
TO220V = drill 1.016 long: 1 -2.54,-2.54; 2 0,-2.54; 3 2.54,-2.54
TO220BV = drill 1.016 long: D 0,-2.54; G -2.54,-2.54; S 2.54,-2.54
TO92 = drill 0.813 octagon: 1 1.27,0; 2 0,1.905; 3 -1.27,0
0204V = drill 0.813 octagon: 1 -1.27,0; 2 1.27,0
0207/10 = drill 0.813 octagon: 1 -5.08,0; 2 5.08,0
0414/15 = drill 1.016 octagon: 1 -7.62,0; 2 7.62,0
VTA54 = drill 1.1 octagon: 1 -12.065,0; 2 12.065,0
0204/5 = drill 0.813 octagon: 1 -2.54,0; 2 2.54,0
R1218 = smd 1.05 x 4.9: 1 -1.475,0; 2 1.475,0
0204/7 = drill 0.813 octagon: 1 -3.81,0; 2 3.81,0
R1206 = smd 1.6 x 1.803: 1 -1.422,0; 2 1.422,0
RTRIM3296W = drill 0.61 round: 1 0,-2.54; 2 0,0; 3 0,2.54
ML40 = drill 0.914 octagon: 1 -24.13,-1.27; 2 -24.13,1.27; 3 -21.59,-1.27; 4 -21.59,1.27; 5 -19.05,-1.27; 6 -19.05,1.27; 7 -16.51,-1.27; 8 -16.51,1.27; 9 -13.97,-1.27; 10 -13.97,1.27; 11 -11.43,-1.27; 12 -11.43,1.27; 13 -8.89,-1.27; 14 -8.89,1.27; 15 -6.35,-1.27; 16 -6.35,1.27; 17 -3.81,-1.27; 18 -3.81,1.27; 19 -1.27,-1.27; 20 -1.27,1.27; 21 1.27,-1.27; 22 1.27,1.27; 23 3.81,-1.27; 24 3.81,1.27; 25 6.35,-1.27; 26 6.35,1.27; 27 8.89,-1.27; 28 8.89,1.27; 29 11.43,-1.27; 30 11.43,1.27; 31 13.97,-1.27; 32 13.97,1.27; 33 16.51,-1.27; 34 16.51,1.27; 35 19.05,-1.27; 36 19.05,1.27; 37 21.59,-1.27; 38 21.59,1.27; 39 24.13,-1.27; 40 24.13,1.27
TMV_DUAL = drill 0.9 round: 1 -7.62,0; 2 -5.08,0; 5 2.54,0; 6 5.08,0; 7 7.62,0
AK500/3-H = drill 1.321 long: 1 -5.004,0; 2 0,0; 3 5.004,0
AK500/4-H = drill 1.321 long: 1 -7.518,0; 2 -2.489,0; 3 2.489,0; 4 7.518,0

### Placement (x,y rotation side)
C201  66.04,117.47 180 top
C202  50.8,117.47 0 top
C203  2.54,122.56 90 top
C204  13.34,121.92 90 top
C205  13.34,129.54 270 top
C206  2.54,128.91 270 top
C207  58.42,117.47 180 top
C301  13.97,54.61 0 top
C302  13.97,26.67 0 top
C401  3.17,95.25 0 top
C402  13.34,98.42 90 top
C403  15.88,98.42 90 top
C404  3.17,102.87 0 top
C405  35.56,74.93 0 top
C406  45.72,74.93 0 top
C407  62.23,74.93 0 top
C408  72.39,74.93 0 top
C409  84.45,101.6 270 top
C410  75.56,102.23 270 top
C411  75.56,94.61 90 top
C412  84.45,95.25 90 top
C501  71.12,114.94 90 top
C502  88.9,114.94 270 top
C503  63.5,126.36 270 bottom
C504  76.2,126.36 270 bottom
C505  42.55,125.73 270 top
C506  22.23,125.73 270 top
C507  83.82,125.09 270 bottom
C508  71.12,125.09 270 bottom
D301  17.78,6.35 270 top
D302  13.97,92.08 0 top
H301  39.37,36.83 0 top
H302  39.37,55.88 0 top
H303  67.31,55.88 0 top
H304  67.31,36.83 0 top
H305  67.31,20.32 0 top
IC201  7.62,125.73 90 top
IC401  35.56,82.55 180 bottom
IC402  45.72,82.55 180 bottom
IC403  7.62,98.42 90 top
IC404  81.28,98.42 270 top
IC405  62.23,82.55 180 bottom
IC406  72.39,82.55 180 bottom
IC501  80.01,125.73 0 top
IC502  67.31,125.73 0 top
IC503  52.7,125.73 0 top
K301  13.97,78.74 270 top
KK201  7.62,125.73 270 top
MOD1  64.77,107.95 180 top
Q1  66.04,132.08 180 top
Q301  11.43,6.35 90 top
Q302  39.37,35.56 0 top
Q303  39.37,54.61 0 top
Q304  67.31,35.56 0 top
Q305  67.31,54.61 0 top
Q306  67.31,19.05 0 top
Q307  24.13,87.63 270 top
Q401  60.33,98.42 270 top
Q402  65.41,98.42 270 top
Q403  52.7,98.42 90 top
Q404  72.39,98.42 270 top
R1  50.16,133.35 270 top
R2  60.33,133.35 270 top
R3  33.66,140.97 180 top
R301  30.48,64.77 270 top
R302  48.26,64.77 90 top
R303  25.4,67.94 270 top
R304  34.92,64.77 90 top
R305  2.54,78.74 90 top
R306  82.55,24.13 270 top
R307  89.53,24.13 270 top
R308  20.32,6.35 270 top
R309  58.42,45.72 270 top
R310  71.75,64.77 90 top
R311  53.34,29.21 270 top
R312  67.31,64.77 270 top
R313  76.2,64.77 90 top
R314  76.2,29.21 270 top
R315  87.63,64.14 270 top
R316  82.55,64.14 90 top
R317  87.63,53.34 180 bottom
R318  85.09,64.14 90 top
R319  82.55,53.34 0 bottom
R320  26.67,95.89 270 top
R321  25.4,83.82 0 top
R322  78.74,82.55 270 top
R401  30.48,73.66 270 bottom
R402  40.64,73.66 270 bottom
R403  67.31,73.66 270 bottom
R404  77.47,73.66 270 bottom
R405  56.52,95.89 270 top
R406  56.52,100.97 90 top
R407  68.58,99.69 270 top
R408  50.16,98.42 270 top
R501  78.74,114.94 90 top
R502  74.93,114.94 0 top
R503  45.09,133.35 270 top
R504  81.28,114.94 90 top
R505  57.78,133.35 270 top
R506  85.09,114.94 0 top
R507  43.81,140.97 180 top
R508  45.72,113.03 90 top
R509  34.92,133.35 90 top
R510  27.3,133.35 90 top
R511  37.47,133.35 90 top
R512  22.23,135.89 90 top
R513  24.77,135.89 90 top
SV101  48.9,146.69 0 top
V201  57.15,114.94 0 top
V501  32.38,125.73 0 top
X101  29.21,7.62 0 top
X102  44.45,7.62 0 top
X103  62.23,7.62 0 top

### Tracks (layer width: path | path; a pad name or v marks a point on that pad's centre or on a via)
!MCU_EN_G1  (via drill 0.5 pad 2.18)
  Bottom 0.813: SV101.2 23.5,147.96 22.23,146.69 R512.2 17.78,135.25 17.78,102.23 24.77,95.25 27.94,95.25 34.29,88.9 IC401.2
  other vias: 24.77,147.96 22.23,139.7
!MCU_EN_G2  (via drill 0.5 pad 2.18)
  Bottom 0.813: IC402.2 44.45,88.9 43.81,89.53 35.56,89.53 28.57,96.52 25.4,96.52 19.05,102.87 19.05,133.99 R513.2 SV101.1
  other vias: 24.77,145.41 24.77,139.7
+5V  (via drill 0.5 pad 2.18)
  Top 0.813: IC201.OUT 8.89,128.27 7.93,127.31 7.93,122.23 8.88,121.28 14.61,121.28 18.41,117.47 C202.1
  Top 1.016: IC201.OUT 12.06,130.18 24.13,130.18 v24.77,129.54
  Bottom 0.813: IC503.14 R503.2 | v24.77,129.54 R513.1 R512.1 | SV101.12 37.47,149.22 33.02,153.67 17.78,153.67 13.97,149.86 13.97,135.25 10.16,131.44 IC201.OUT | R508.2 45.72,114.94 C202.1
  Bottom 1.016: v24.77,129.54 24.77,128.27 27.3,125.73 42.55,125.73 45.09,128.27 IC503.14 43.81,129.54 C505.1 | C202.1 49.53,116.2 V201.1
  Bottom 1.27: C206.+ 8.26,130.18 IC201.OUT 13.34,131.44 C205.1 | C506.1 23.5,129.54 v24.77,129.54
  other vias: 13.34,132.08 10.16,128.27 2.54,130.18 45.09,129.54 42.55,128.27 22.23,128.27 24.77,132.08 22.23,132.08 45.09,132.08 49.53,114.94 48.26,117.47 45.72,114.3 37.47,147.96
+15V  (via drill 0.5 pad 2.18)
  Top 0.813: v79.38,145.41 79.38,132.72 IC501.8
  Top 1.016: C201.1 71.12,120.02 72.39,120.02 73.66,121.28 73.66,124.46 76.2,127 IC501.8
  Bottom 0.813: SV101.20 52.07,152.4 72.39,152.4 v79.38,145.41
  Bottom 1.016: IC502.8 63.5,127.64 76.2,127.64 IC501.8 | C201.1 66.04,114.94 V201.7 MOD1.1
  Bottom 1.27: 63.5,127.64 C503.1 | 76.2,127.64 C504.1
  other vias: 76.2,129.54 63.5,129.54 76.2,129.54 64.77,114.94 68.58,117.47 64.77,107.95 47.62,147.96
-15V  (via drill 0.5 pad 2.18)
  Top 0.813: v81.92,145.41 81.92,133.99 85.72,130.18 85.72,123.83 IC501.4
  Bottom 0.813: SV101.18 50.8,153.67 73.66,153.67 v81.92,145.41
  Bottom 1.016: IC502.4 68.58,119.38 57.78,119.38 C207.2 58.42,114.94 V201.5 MOD1.3
  Bottom 1.27: IC502.4 71.12,123.83 | 71.12,123.83 83.82,123.83 | 83.82,123.83 IC501.4 | 71.12,123.83 C508.2 | 83.82,123.83 C507.2
  other vias: 71.12,121.92 59.69,114.94 55.88,117.47 83.82,121.92 59.69,107.95 45.09,147.96
AGND  (via drill 0.5 pad 2.18)  (2 unrouted)
  Top 1.016: v90.17,104.78 88.9,106.05 81.28,106.05 76.83,110.49 66.04,110.49 62.23,114.3 V201.6 62.23,117.47 | 62.23,117.47 C207.1 | 62.23,117.47 C201.2
  Bottom 0.813: R506.2 v85.09,117.47 v88.9,117.47 91.44,117.47
  Bottom 1.016: 62.23,117.47 C207.1 | 62.23,117.47 C201.2 | 62.23,117.47 V201.6 MOD1.2
  Bottom 1.27: R318.2 85.09,74.93 90.81,80.64 90.81,104.14 v90.17,104.78 90.17,107.95 91.44,109.22 91.44,117.47 91.44,125.73 | 83.82,125.73 76.2,125.73 | 76.2,125.73 71.12,125.73 | 71.12,125.73 63.5,125.73 C503.2 | 71.12,125.73 C508.1 | 76.2,125.73 C504.2 | 83.82,125.73 C507.1 | SV101.17 R507.1 45.09,140.34 46.99,138.43 48.9,138.43 50.16,139.7 77.47,139.7 91.44,125.73 | 91.44,125.73 83.82,125.73
  other vias: 81.28,129.54 83.82,129.54 85.09,114.94 85.09,69.22 62.23,114.94 63.5,117.47 60.96,117.47 62.23,107.95 45.09,145.41 45.09,140.97
ANALOG_IN_AC  (via drill 0.5 pad 2.18)
  Bottom 0.813: v74.93,117.47 R502.2 | v74.93,117.47 76.2,118.75 IC501.1 | v74.93,117.47 v71.12,117.47 67.31,113.67 67.31,106.68 66.04,105.41 59.69,105.41 MOD1.4
  other vias: 57.15,107.95 76.2,121.92 74.93,114.94
BR  (via drill 0.5 pad 2.18)
  Top 0.813: v88.9,109.86 90.81,111.76 90.81,139.06 78.11,151.76 v42.55,151.76
  Bottom 0.813: v88.9,109.86 85.09,109.86 81.92,113.03 78.11,113.03 69.22,104.14 58.42,104.14 R406.2 | v42.55,151.76 SV101.16
  other vias: 42.55,147.96 56.52,102.23
DC+  (via drill 0.5 pad 2.18, 0.5 pad 3.81)
  Bottom 1.27: X103.2 59.74,3.86 58.42,2.54 25.4,2.54 24.13,3.81 v24.13,7.62 24.13,7.54 X101.1 22.94,6.35
  Bottom 2.184: v24.13,7.62 22.86,6.35 12.7,6.35 Q301.2
  other vias: 13.97,6.35
DC++  (via drill 0.5 pad 2.18, 0.5 pad 2.54, 0.5 pad 3.05, 0.6)
  Top 1.016: v15.88,95.89 25.4,105.41 72.39,105.41 75.56,102.23 77.47,102.23 IC404.IN
  Top 1.27: v10.16,95.89 v13.34,95.89 v15.88,95.89 | 39.37,72.39 v35.56,72.39 | v39.37,62.23 39.37,72.39 | 39.37,72.39 40.64,72.39 C406.1
  Top 2.184: v13.97,40.64 19.68,40.64 v26.04,46.99
  Bottom 0.813: v34.92,147.96 34.92,149.22 31.75,152.4 18.41,152.4 15.24,149.22 15.24,123.83 13.97,122.56 10.79,122.56 IC201.IN
  Bottom 1.016: 31.75,74.93 C405.1 | 31.75,74.93 IC401.8 | v35.56,72.39 33.66,72.39 31.75,74.3 31.75,74.93 | K301.P 13.97,95.89
  Bottom 1.27: Q303.3 48.26,58.42 R302.1 | Q302.3 43.18,33.02 44.45,34.29 44.45,39.37 30.48,53.34 R301.2 | R305.2 3.94,86.23 K301.1 8,91.19 D302.C | C409.+ 80.64,102.87 IC404.IN 75.56,104.14 C410.1 | 31.75,74.93 R401.1 | v15.88,95.89 13.97,95.89 v13.34,95.89 v10.16,95.89 8.26,95.89 5.08,92.71 3.81,92.71 v1.91,95.25 v1.91,102.87 1.91,114.94 8.26,121.28 | 8.26,121.28 v2.54,121.28 | 8.26,121.28 IC201.IN 13.34,120.02 C204.1 | 13.97,86.36 13.84,86.23 | 41.91,74.93 40.79,74.93 R402.1 | C406.1 41.91,74.93 | 41.91,74.93 IC402.8
  Bottom 2.184: Q301.3 v13.97,40.64 13.97,86.36 K301.P | Q301.3 12.7,8.89 | Q301.3 D301.C | 41.91,50.16 Q303.3 41.91,59.69 v39.37,62.23 29.21,62.23 27.94,60.96 27.94,52.07 33.02,46.99 | 33.02,46.99 41.91,38.1 Q302.3 41.91,31.11 | v26.04,46.99 33.02,46.99 | 13.84,86.23 K301.1
  other vias: 30.48,59.69 17.78,8.89 41.91,52.07 41.91,33.02 48.26,59.69 43.18,74.93 33.02,74.93 78.74,100.97 13.34,119.38 10.16,123.19 78.74,100.97 75.56,104.78 84.45,102.87 13.97,88.27 13.97,8.89
DC-  (via drill 0.5 pad 1.93, 0.5 pad 2.18, 0.5 pad 3.81, 0.5 pad 4.57)
  Bottom 1.016: 13.34,98.42 IC403.IN | 13.34,98.42 C402.2 | 13.34,98.42 16.51,98.42 18.41,96.52 18.41,95.25 16.51,93.34 16.51,84.45 19.05,81.92 24.13,81.92 | R319.1 84.03,52.07 86.16,52.07 R317.1 86.16,54.61 85.09,54.61 84.03,54.61
  Bottom 1.27: Q306.S 76.2,22.86 R314.2 | R308.1 22.86,11.43 29.21,11.43 | 20.95,65.41 22.86,65.41 22.86,78.74 24.13,80.01 24.13,81.92 R321.1 Q307.1 | R322.2 80.01,77.47 80.01,65.41 | IC403.IN 7.62,98.42 C401.- | R313.1 79.38,59.69 81.28,61.59 | 85.09,61.59 81.28,61.59 | R312.2 69.85,62.23 80.64,62.23 81.28,61.59
  Bottom 2.184: Q306.S 82.55,16.51 92.71,26.67 92.71,59.69 90.17,62.23 85.09,62.23 | X101.2 29.21,11.43 29.21,12.7 19.05,22.86 C302.- C301.- 19.05,63.5 20.95,65.41 80.01,65.41 83.19,62.23 85.09,62.23 | 85.09,62.23 85.09,61.59 v85.09,59.05 85.09,54.61
  other vias: 76.2,24.13 19.05,26.67 19.05,54.61 29.21,7.62 69.85,16.51 20.32,8.89 24.13,86.36 24.13,83.82 78.74,78.74 4.45,95.25 10.16,98.42 13.34,100.97 76.2,59.69 67.31,59.69
DC--  (via drill 0.5 pad 2.18)  (1 unrouted)
  Bottom 1.016: IC405.5 v66.04,78.74 66.04,80.01 66.67,80.64 76.2,80.64 | 76.2,80.64 v76.2,78.74 | C411.2 C410.2 75.56,98.42 IC404.GND | 76.2,80.64 81.92,80.64
  Bottom 1.27: 84.45,98.42 IC404.GND | 84.45,98.42 C412.- | 84.45,98.42 C409.- | 84.45,98.42 85.72,98.42 87,97.16 87,85.72 81.92,80.64 | C407.2 66.04,74.93 | 66.04,74.93 67.16,74.93 R403.1 | 66.04,74.93 IC405.5 | C408.2 76.2,74.93 | 76.2,74.93 77.32,74.93 R404.1 | 76.2,74.93 IC406.5
  other vias: 64.77,74.93 74.93,74.93 78.74,98.42 75.56,99.69 84.45,100.33 84.45,96.52 75.56,97.16
DCB_CAP+  (via drill 0.5 pad 2.54, 0.5 pad 3.05, 0.5 pad 4.57)
  Bottom 1.27: 8.89,71.12 R305.1
  Bottom 2.184: C302.+ C301.+ 8.89,71.12 8.89,73.15 K301.S
  other vias: 8.89,26.67 8.89,54.61 2.54,71.12 8,74.04
EN_OR_PWM  (via drill 0.5 pad 1.52, 0.5 pad 2.18)
  Top 0.813: R511.1 39.37,133.99 39.37,135.25 38.1,136.53 32.38,136.53 29.84,139.06 v29.84,140.97
  Bottom 0.813: V501.12 32.38,127 34.92,127 v37.47,129.54 | v29.84,140.97 v29.84,145.41
  Bottom 1.016: v37.47,129.54 R511.1
  other vias: 37.47,132.08 29.84,129.54
G1  (via drill 0.5 pad 2.18)
  Bottom 1.016: 35.56,77.78 IC401.7 | 35.56,77.78 IC401.6 | v25.4,73.03 25.4,76.2 29.84,80.64 34.92,80.64 35.56,80.01 35.56,77.78
G2  (via drill 0.5 pad 2.18)
  Bottom 1.016: R304.2 36.83,67.94 49.53,67.94 50.8,69.22 50.8,70.48 49.53,71.75 46.35,71.75 45.72,72.39 45.72,77.78
  Bottom 1.27: IC402.7 45.72,77.78 IC402.6
  other vias: 34.92,69.85
G3  (via drill 0.5 pad 2.18)
  Top 1.016: v58.42,62.23 58.42,71.12 v59.69,72.39
  Bottom 1.27: 62.23,77.78 IC405.7 | 62.23,77.78 IC405.6 | R309.1 v58.42,62.23 | v59.69,72.39 60.33,72.39 62.23,74.3 62.23,77.78
G4  (via drill 0.5 pad 2.18)
  Bottom 1.016: IC406.7 72.39,77.78 IC406.6 | R310.2 71.75,73.03 72.39,73.66 72.39,77.47
  Bottom 1.27: 72.39,77.47 72.39,77.78
  other vias: 71.75,69.85
G_BR  (via drill 0.5 pad 2.18)
  Top 0.813: v64.14,95.89 53.34,85.09 R311.1
  Bottom 0.813: v64.14,95.89 v71.12,95.89
  other vias: 53.34,34.29
GATE_+15V  (via drill 0.5 pad 2.18)
  Top 0.813: v59.05,95.89 Q402.C
  Bottom 0.813: v78.74,95.89 77.47,94.61 75.56,94.61 74.93,93.98 60.96,93.98 v59.05,95.89 58.42,95.89 57.15,94.61 v56.52,94.61
  Bottom 1.016: C407.1 58.42,76.2 v58.42,78.74 58.42,82.55 | IC406.8 68.58,76.83 69.85,75.56 C408.1 69.85,69.22 68.58,67.94 58.42,67.94 56.52,69.85 56.52,81.28 57.78,82.55 58.42,82.55 | 58.42,82.55 80.64,82.55 84.45,86.36 C412.+
  Bottom 1.27: 58.42,76.2 IC405.8 | C412.+ 80.64,93.98 v78.74,95.89 75.56,92.71 v75.56,92.08
  other vias: 69.85,74.93 59.69,74.93 84.45,93.98 64.14,100.97
GATE_-15V  (via drill 0.5 pad 2.18, 0.6)
  Bottom 0.813: C405.2 38.1,75.56 39.37,76.83 v39.37,78.74
  Bottom 1.016: 39.37,82.55 v39.37,78.74 39.37,77.47 | 39.37,82.55 46.99,82.55 49.53,80.01 v49.53,78.74 IC402.5 | 39.37,82.55 31.11,82.55 29.21,84.45 29.21,92.08 27.3,93.98 23.5,93.98 16.51,100.97 C403.2
  Bottom 1.27: C406.2 49.53,76.2 IC402.5 | 39.37,77.47 IC401.5 | C403.2 15.88,101.6 13.97,103.5 12.7,103.5 IC403.OUT 8.26,102.87 C404.-
  other vias: 48.26,74.93 38.1,74.93 10.16,100.97 4.45,102.87 10.16,100.97 15.88,100.97
GND  (via drill 0.5 pad 2.18, 0.6 pad 2.18)
  Top 1.27: IC201.GND 19.68,125.73 C506.2
  Bottom 0.813: 60.33,124.46 v60.33,129.54 R2.2 | V201.2 52.07,116.2 C202.2 52.7,118.11 IC503.4 | v36.83,86.36 36.83,87.63 | Q403.E 51.44,100.97 R408.1 52.07,101.6 MOD1.6 | R2.2 R505.2 | Q1.E 61.59,133.35 R2.2
  Bottom 1.016: 50.16,124.46 52.7,124.46 | 52.7,124.46 55.24,124.46 | 55.24,124.46 57.78,124.46 | 57.78,124.46 60.33,124.46 v60.33,121.92 | 57.78,124.46 IC503.6 | 55.24,124.46 IC503.5 | 52.7,124.46 IC503.4 | 50.16,124.46 IC503.3 | C506.2 23.5,124.46 40.01,124.46 | 40.01,124.46 42.55,124.46 | 42.55,124.46 50.16,124.46 | 42.55,124.46 C505.2 | 40.01,124.46 v40.01,121.92 | 46.99,83.82 v46.99,86.36 | 46.99,83.82 38.1,83.82 36.83,85.09 v36.83,86.36 | 46.99,83.82 53.34,83.82 63.5,83.82 | 63.5,83.82 73.66,83.82 | 73.66,83.82 v73.66,86.36 | 63.5,83.82 v63.5,86.36 | 73.66,83.82 77.47,83.82 78.74,85.09 R322.1 | V201.2 MOD1.6
  Bottom 1.27: v46.99,86.36 IC402.3 | v73.66,86.36 IC406.3 | v63.5,86.36 IC405.3 | 20.32,123.19 20.32,103.5 25.4,98.42 28.57,98.42 35.87,91.13 49.21,91.13 53.34,87 53.34,83.82 | v60.33,121.92 IC502.1 | 2.54,125.73 C203.- | 2.54,125.73 C206.- | 2.54,125.73 IC201.GND 13.34,125.73 C205.2 C204.2 | 20.32,123.19 C506.2 | 20.32,123.19 20.32,133.35 21.59,134.62 R510.2 R509.2 R511.2 32.38,134.62 R3.2 v32.38,145.41 v32.38,147.96 | v36.83,86.36 IC401.3 36.83,87.63
  other vias: 10.16,125.73 13.34,127 13.34,124.46 2.54,127.64 2.54,123.83 42.55,123.19 22.23,123.19 27.3,134.62 34.92,134.62 37.47,134.62 57.78,132.08 78.74,86.36 63.5,121.92 50.16,121.92 52.7,121.92 55.24,121.92 57.78,121.92 53.34,117.47 52.07,114.94 52.07,107.95 53.98,100.97 50.16,99.69 32.38,140.97 63.5,133.35 60.33,132.08
LM311_PIN7  (via drill 0.5 pad 2.18)
  Top 0.813: R508.1 44.45,113.03 v15.88,113.03
  Bottom 0.813: v15.88,113.03 16.51,113.67 16.51,148.59 19.05,151.13 27.94,151.13 29.84,149.22 v29.84,147.96 | MOD1.7 49.53,111.12 48.9,111.76 R508.1
  other vias: 45.72,111.76 49.53,107.95
M+  (via drill 0.5 pad 2.18)
  Bottom 2.184: 67.31,34.29 67.31,35.56 Q304.D 67.31,30.48 63.5,26.67 39.37,26.67 | X102.1 39.45,11.35 39.37,11.43 39.37,26.67 | 39.37,26.67 Q302.2 39.37,35.56 39.37,34.92
  other vias: 39.37,33.02 67.31,33.02
M-  (via drill 0.5 pad 2.18, 0.5 pad 3.81)
  Top 2.184: X102.2 v44.45,10.79 44.45,29.21 v45.72,30.48
  Bottom 2.184: 67.31,54.61 Q305.D 67.31,49.53 64.77,46.99 53.34,46.99 | 39.37,54.61 Q303.2 39.37,48.9 41.27,46.99 53.34,46.99 | X102.2 v44.45,10.79 | v45.72,30.48 47.62,32.38 47.62,39.37 53.34,45.09 53.34,46.99
  other vias: 44.45,7.62 39.37,52.07 67.31,52.07
MCU_EN_G3  (via drill 0.5 pad 1.52, 0.5 pad 2.18)
  Top 0.813: v27.3,140.97 27.3,139.7 R509.1
  Bottom 0.813: v27.3,140.97 v27.3,145.41
  Bottom 1.016: V501.10 R509.1
  other vias: 34.92,132.08 34.92,129.54
MCU_EN_G4  (via drill 0.5 pad 1.52, 0.5 pad 2.18)
  Top 0.813: R510.1 18.41,140.97 v18.41,147.96
  Bottom 0.813: V501.13 R510.1 | v18.41,147.96 20.32,149.86 26.67,149.86 27.3,149.22 v27.3,147.96
  other vias: 27.3,132.08 27.3,129.54
N$1
  Top 1.27: 58.42,41.27 58.42,50.16
N$2  (via drill 0.5 pad 6.45)
  other vias: 5,5
N$3  (via drill 0.5 pad 6.45)
  other vias: 90,5
N$4  (via drill 0.5 pad 6.45)
  other vias: 5,150
N$5  (via drill 0.5 pad 6.45)
  other vias: 90,150
N$6  (via drill 0.5 pad 2.18)
  Bottom 0.813: IC501.2 R501.2 78.74,116.2 R502.1 C501.1
  other vias: 78.74,118.75 78.74,121.92 71.12,112.39 74.93,112.39
N$7  (via drill 0.5 pad 3.05)
  other vias: 2.54,86.36
N$8  (via drill 0.5 pad 2.18)
  other vias: 31.75,78.74
N$9  (via drill 0.5 pad 2.18)
  other vias: 34.29,78.74
N$10  (via drill 0.5 pad 2.18)
  Bottom 0.813: IC501.3 R504.2 81.28,116.2 R506.1 C502.2
  other vias: 81.28,121.92 81.28,118.75 85.09,112.39 88.9,112.39
N$11  (via drill 0.5 pad 2.18)
  Bottom 0.813: v56.52,99.69 55.88,99.69 54.61,98.42 Q403.B 52.7,98.42 51.44,97.16 R408.2
  other vias: 50.16,97.16 53.98,98.42
N$12  (via drill 0.5 pad 1.93)
  Bottom 1.27: K301.2 19.94,88.9 | 19.94,88.9 19.94,91.19 D302.A | 19.94,88.9 Q307.3
  other vias: 24.13,88.9
N$13
  Bottom 1.016: 30.48,72.39 30.48,74.93
N$14  (via drill 0.5 pad 1.52)
  other vias: 45.09,121.92
N$15  (via drill 0.5 pad 1.93, 0.5 pad 2.18)
  Bottom 1.27: R321.2 26.67,87.63 | 26.67,87.63 Q307.2 | 26.67,87.63 R320.2
  other vias: 26.67,90.81 26.04,87.63 26.67,83.82
N$16  (via drill 0.5 pad 2.18)
  Top 0.813: v40.01,151.76 41.91,153.67 78.11,153.67 92.08,139.7 92.08,109.22 93.98,107.31 93.98,106.05 93.34,105.41 93.34,43.81 87.63,38.1 85.09,38.1 84.45,38.73 84.45,41.27 90.17,46.99 90.17,78.74 80.01,88.9 74.93,88.9 70.48,88.9 66.67,92.71 66.67,100.97 63.5,104.14 29.84,104.14 R320.1
  Bottom 0.813: v40.01,151.76 SV101.14
  other vias: 40.01,147.96 26.67,100.97
N$17  (via drill 0.5 pad 1.52)
  other vias: 47.62,121.92
N$18  (via drill 0.5 pad 2.18)
  other vias: 48.26,69.85
N$19  (via drill 0.5 pad 2.18)
  Bottom 2.184: 12.7,3.81 Q301.1 D301.A R308.2
  other vias: 17.78,3.81 20.32,3.81 13.97,3.81
N$20  (via drill 0.5 pad 2.18)
  Bottom 1.27: R311.2 57.15,24.13 Q306.G
  other vias: 53.34,24.13 64.77,16.51
N$21  (via drill 0.5 pad 2.54)
  other vias: 19.94,74.04
N$22  (via drill 0.5 pad 2.54)
  other vias: 8,86.23
N$23  (via drill 0.5 pad 2.18)
  other vias: 67.31,69.85
N$24  (via drill 0.5 pad 3.81)
  other vias: 39.37,7.62
N$25  (via drill 0.5 pad 2.54)
  other vias: 19.94,86.23
N$26  (via drill 0.5 pad 3.81)
  other vias: 54.61,7.62
N$27  (via drill 0.5 pad 3.81)
  other vias: 59.69,7.62
N$28  (via drill 0.5 pad 2.18)
  other vias: 36.83,78.74
N$29  (via drill 0.5 pad 2.18)
  other vias: 41.91,78.74
N$30  (via drill 0.5 pad 2.18)
  other vias: 58.42,50.8
N$31  (via drill 0.5 pad 2.18)
  other vias: 50.16,129.54
N$32  (via drill 0.5 pad 2.18)
  other vias: 8.89,92.08
N$33  (via drill 0.5 pad 2.18)
  other vias: 19.05,92.08
N$34  (via drill 0.5 pad 2.18)
  other vias: 44.45,78.74
N$35  (via drill 0.5 pad 2.18)
  other vias: 76.2,34.29
N$36  (via drill 0.5 pad 2.18)
  other vias: 46.99,78.74
N$37  (via drill 0.5 pad 2.18)
  Top 0.61: 33.66,130.81 33.66,128.27 | 28.57,128.27 28.57,130.81
  Top 0.813: V501.2 27.3,123.19 28.57,124.46 28.57,128.27 | 28.57,130.81 29.84,132.08 32.38,132.08 33.66,130.81 | 33.66,128.27 34.92,127 38.73,127 40.01,128.27 v40.01,129.54
  other vias: 27.3,121.92
N$38  (via drill 0.5 pad 1.52, 0.5 pad 2.18)
  Top 0.813: V501.5 34.92,124.46 32.38,127 V501.11
  other vias: 34.92,121.92 32.38,129.54
N$39  (via drill 0.5 pad 2.18)
  other vias: 49.53,86.36
N$40  (via drill 0.5 pad 2.18)
  other vias: 44.45,86.36
N$41  (via drill 0.5 pad 2.18)
  other vias: 41.91,86.36
N$42  (via drill 0.5 pad 2.18)
  other vias: 46.99,107.95
N$43  (via drill 0.5 pad 2.18)
  other vias: 39.37,86.36
N$44  (via drill 0.5 pad 2.18)
  other vias: 34.29,86.36
N$45  (via drill 0.5 pad 2.18)
  other vias: 31.75,86.36
N$46  (via drill 0.5 pad 2.18)
  other vias: 58.42,86.36
N$47  (via drill 0.5 pad 2.18)
  other vias: 60.96,86.36
N$48  (via drill 0.5 pad 2.18)
  other vias: 66.04,86.36
N$49  (via drill 0.5 pad 2.18)
  other vias: 68.58,86.36
N$50  (via drill 0.5 pad 2.18)
  other vias: 71.12,86.36
N$51  (via drill 0.5 pad 2.18)
  other vias: 76.2,86.36
N$52  (via drill 0.5 pad 2.18)
  other vias: 73.66,78.74
N$53  (via drill 0.5 pad 2.18)
  other vias: 71.12,78.74
N$54  (via drill 0.5 pad 2.18)
  other vias: 68.58,78.74
N$55  (via drill 0.5 pad 2.18)
  other vias: 63.5,78.74
N$56  (via drill 0.5 pad 2.18)
  other vias: 60.96,78.74
N$57  (via drill 0.5 pad 2.18)
  other vias: 71.12,129.54
N$58  (via drill 0.5 pad 2.18)
  other vias: 68.58,129.54
N$59  (via drill 0.5 pad 2.18)
  other vias: 78.74,129.54
N$60  (via drill 0.5 pad 6.45)
  other vias: 6.86,138.43
N$61  (via drill 0.5 pad 6.45)
  other vias: 6.86,113.03
N$62
  Top 1.27: 30.48,60.33 30.48,69.22
N$63
  Top 1.27: 34.92,60.33 34.92,69.22
N$64  (via drill 0.5 pad 1.27, 0.5 pad 2.18)
  Bottom 0.813: v53.98,95.89 54.61,95.89 55.88,97.16 R405.1 57.15,97.16 58.42,98.42 Q401.B
  other vias: 59.05,98.42 56.52,97.16 59.05,98.42
N$65  (via drill 0.5 pad 2.18)
  other vias: 50.16,145.41
N$66  (via drill 0.5 pad 2.18)
  other vias: 52.7,145.41
N$67  (via drill 0.5 pad 2.18)
  other vias: 55.24,145.41
N$68  (via drill 0.5 pad 2.18)
  other vias: 57.78,145.41
N$69  (via drill 0.5 pad 2.18)
  other vias: 60.33,145.41
N$70  (via drill 0.5 pad 2.18)
  other vias: 62.87,145.41
N$71  (via drill 0.5 pad 2.18)
  other vias: 65.41,145.41
N$72  (via drill 0.5 pad 2.18)
  other vias: 67.94,145.41
N$73  (via drill 0.5 pad 2.18)
  other vias: 70.48,145.41
N$74  (via drill 0.5 pad 2.18)
  other vias: 73.03,145.41
N$75  (via drill 0.5 pad 2.18)
  other vias: 73.03,147.96
N$76  (via drill 0.5 pad 2.18)
  other vias: 70.48,147.96
N$77  (via drill 0.5 pad 2.18)
  other vias: 67.94,147.96
N$78  (via drill 0.5 pad 2.18)
  other vias: 65.41,147.96
N$79  (via drill 0.5 pad 2.18)
  other vias: 62.87,147.96
N$80  (via drill 0.5 pad 2.18)
  other vias: 60.33,147.96
N$81  (via drill 0.5 pad 2.18)
  other vias: 57.78,147.96
N$82  (via drill 0.5 pad 2.18)
  other vias: 55.24,147.96
N$83  (via drill 0.5 pad 2.18)
  other vias: 52.7,147.96
N$84  (via drill 0.5 pad 2.18)
  other vias: 50.16,147.96
N$85
  Bottom 1.016: 40.64,72.39 40.64,74.93
N$86
  Top 1.27: 48.26,60.33 48.26,69.22
N$87  (via drill 0.5 pad 2.18)
  Bottom 0.813: Q404.B R407.2 Q402.B 62.87,98.42 60.33,100.97 Q401.C
  other vias: 64.14,98.42 59.05,100.97 68.58,98.42 71.12,98.42
N$88
  Top 1.27: 67.31,60.33 67.31,69.22
N$89
  Top 1.27: 76.2,24.77 76.2,33.66
N$90
  Top 1.27: 53.34,24.77 53.34,33.66
N$91
  Bottom 1.016: 67.31,72.39 67.31,74.93
N$92
  Top 1.27: 71.75,60.33 71.75,69.22
N$93
  Top 1.27: 76.2,60.33 76.2,69.22
N$94
  Top 1.27: 85.09,59.69 85.09,68.58
N$95
  Top 1.27: 82.55,59.69 82.55,68.58
N$96
  Top 1.27: 87.63,59.69 87.63,68.58
N$97
  Top 1.27: 25.4,63.5 25.4,72.39
N$98
  Bottom 1.016: 77.47,72.39 77.47,74.93
N$99
  Top 1.27: 78.74,79.38 78.74,85.72
N$100  (via drill 0.5 pad 2.18)
  Bottom 0.813: R1.1 52.07,136.53 60.33,136.53 | 60.33,136.53 62.87,136.53 Q1.B | 60.33,136.53 R2.1
  other vias: 50.16,134.62 66.04,133.35 60.33,134.62
PE  (via drill 0.5 pad 3.81)
  Top 1.27: 49.53,2.54 35.56,2.54 34.29,3.81 v34.29,7.62 | 49.53,2.54 68.58,2.54 69.75,3.71 X103.4 v73.03,7.62 | v34.29,7.62 v34.29,10.79 | v34.29,7.62 34.29,7.54 X101.3 | X102.3 49.45,7.54 v49.53,10.79 49.45,2.62 49.53,2.54
  Bottom 1.27: v34.29,7.62 v34.29,10.79 | v49.53,10.79 v49.53,7.62 | v73.03,7.62 v69.85,7.62
Q1_G  (via drill 0.5 pad 2.18)
  Bottom 1.27: Q302.1 36.83,31.11 36.83,38.1 31.11,43.81 25.4,43.81 22.86,46.35 22.86,60.33 v25.4,62.87
  other vias: 36.83,33.02
Q2_G  (via drill 0.5 pad 2.18)
  Bottom 1.27: R304.1 34.92,53.98 Q303.1 | 36.83,50.16 Q303.1 | Q303.1 36.83,54.61
  other vias: 36.83,52.07 34.92,59.69
Q3_G  (via drill 0.5 pad 2.18)
  Bottom 1.27: R309.2 58.42,39.37 Q304.G | 64.77,31.11 Q304.G | 64.77,35.56 64.77,34.29 Q304.G
  other vias: 58.42,40.64 64.77,33.02
Q4_G  (via drill 0.5 pad 2.18)
  Bottom 1.27: R310.1 69.22,57.15 66.67,57.15 64.77,55.24 Q305.G 64.77,50.16
  other vias: 64.77,52.07 71.75,59.69
RB_EXT  (via drill 0.5 pad 2.18, 0.5 pad 3.05, 0.5 pad 3.81)  (1 unrouted)
  Top 2.184: v64.77,7.62 64.77,11.43 67.31,13.97 Q306.D v67.31,24.13
  Bottom 2.184: Q306.D v67.31,24.13 71.12,27.94 80.01,27.94 82.55,30.48 R306.1 R307.1
  other vias: 67.31,16.51 82.55,36.2 89.53,36.2
RB_INT  (via drill 0.5 pad 3.05)
  Bottom 2.184: X103.1 54.71,10.26 56.52,12.06 R306.2 R307.2
  other vias: 82.55,12.06 89.53,12.06
S1  (via drill 0.5 pad 2.18)
  Bottom 1.27: R301.1 R401.2
  other vias: 30.48,69.85
S2
  Bottom 1.27: R402.2 40.64,70.48 41.27,69.85 R302.2
S3
  Bottom 1.27: R312.1 R403.2
S4  (via drill 0.5 pad 2.18)
  Bottom 1.27: R404.2 77.47,71.12 R313.2
  other vias: 76.2,69.85
S_BR  (via drill 0.5 pad 2.18)
  Top 0.813: v86.36,40.01 92.08,45.72 92.08,78.74 80.64,90.17 74.93,90.17 73.66,91.44 73.66,98.42 Q404.C
  Bottom 0.813: R314.1 77.47,34.29 83.19,40.01 v86.36,40.01 | Q404.C v68.58,100.97
  other vias: 71.12,100.97
SH1+  (via drill 0.5 pad 2.18)
  Top 0.813: R501.1 82.55,107.31 91.44,107.31 v92.08,106.68
  Bottom 0.813: R315.1 87.63,74.93 92.71,80.01 92.71,106.05 v92.08,106.68
  other vias: 87.63,69.22 78.74,111.12
SH1++  (via drill 0.5 pad 2.18)
  Bottom 0.813: R317.2 89.11,55.88 89.11,57.58 v87.63,59.05
  Bottom 2.184: 69.85,31.11 Q304.S 69.85,36.2 71.12,37.47 77.47,37.47 89.53,49.53 89.53,55.45 89.11,55.88
SH2+  (via drill 0.5 pad 2.18)
  Bottom 0.813: R316.2 82.55,74.93 88.9,81.28 88.9,103.5 88.27,104.14 R504.1
  other vias: 81.28,111.12 82.55,69.22
SH2++  (via drill 0.5 pad 2.18)
  Bottom 0.813: R319.2 81.08,55.88 81.08,57.58 v82.55,59.05
  Bottom 2.184: 69.85,54.61 Q305.S 69.85,49.53 71.75,46.99 78.11,46.99 80.64,49.53 80.64,55.45 81.08,55.88
  other vias: 69.85,52.07
SP_CURRENT  (via drill 0.5 pad 2.18)
  Top 0.813: IC502.3 74.3,127.64 74.3,132.72 64.14,142.88 44.45,142.88 v42.55,140.97
  Bottom 1.016: v42.55,140.97 SV101.15
  other vias: 42.55,145.41 68.58,121.92
TR_DISABLE_RESET  (via drill 0.5 pad 2.18)
  Bottom 0.813: IC503.12 R1.2
  other vias: 50.16,132.08
TR_EN  (via drill 0.5 pad 2.18)
  Top 0.813: v37.47,140.97 40.64,137.79 54.61,137.79 R505.1
  Bottom 0.813: v37.47,140.97 SV101.11 | IC503.9 55.88,131.44 55.88,132.72 R505.1
  other vias: 37.47,145.41 57.78,134.62 57.78,129.54
TR_EN_G3  (via drill 0.5 pad 2.18)
  Bottom 0.813: IC405.2 60.96,88.9 60.33,89.53 53.34,89.53 50.16,92.71 36.2,92.71 29.84,99.06 V501.3
  other vias: 29.84,121.92
TR_EN_G4  (via drill 0.5 pad 2.18)
  Bottom 0.813: IC406.2 71.12,88.27 69.85,89.53 62.23,89.53 60.96,90.81 53.98,90.81 50.8,93.98 38.73,93.98 37.47,95.25 v37.47,121.92
TR_EN_GATE  (via drill 0.5 pad 2.18)
  Top 0.61: 46.35,120.65 46.35,123.19
  Top 0.813: IC503.13 47.62,126.36 46.35,125.09 46.35,123.19 | 32.38,119.38 V501.4 | 32.38,119.38 26.04,119.38 24.77,120.65 v24.77,121.92 | 46.35,120.65 45.09,119.38 32.38,119.38
  other vias: 32.38,121.92 47.62,129.54
TR_RESET  (via drill 0.5 pad 2.18)
  Top 0.813: IC503.10 55.24,128.27 56.52,127 64.77,127 66.04,128.27 IC502.7
  Bottom 0.813: IC502.7 68.58,132.08 Q1.C 64.14,137.79 50.8,137.79 49.53,136.53 46.99,136.53 R503.1 40.01,139.7 SV101.13
  other vias: 40.01,145.41 45.09,134.62 55.24,129.54 66.04,129.54 68.58,133.35
TR_SET  (via drill 0.5 pad 2.18)
  Top 0.813: v34.92,140.97 37.47,138.43 38.1,138.43 40.01,136.53 50.8,136.53 52.7,134.62 IC503.11
  Bottom 0.813: v34.92,140.97 v34.92,145.41
  other vias: 52.7,129.54
|ANALOG_IN_AC|  (via drill 0.5 pad 2.18)
  Top 0.813: MOD1.5 54.61,113.67 60.33,119.38 64.77,119.38 66.04,120.65 IC502.2 73.03,128.91 73.03,132.08 64.14,140.97 v47.62,140.97
  Bottom 0.813: v47.62,140.97 SV101.19
  other vias: 54.61,107.95 66.04,121.92 47.62,145.41

### Text on the board
tDocu: DC+ | DC- | PE | M+ | M- | PE | RB_INT | DC+ | RB_EXT | PE